# EAGLE design wchair (EAGLE 9.2.2)

## Sheet 1 of 2
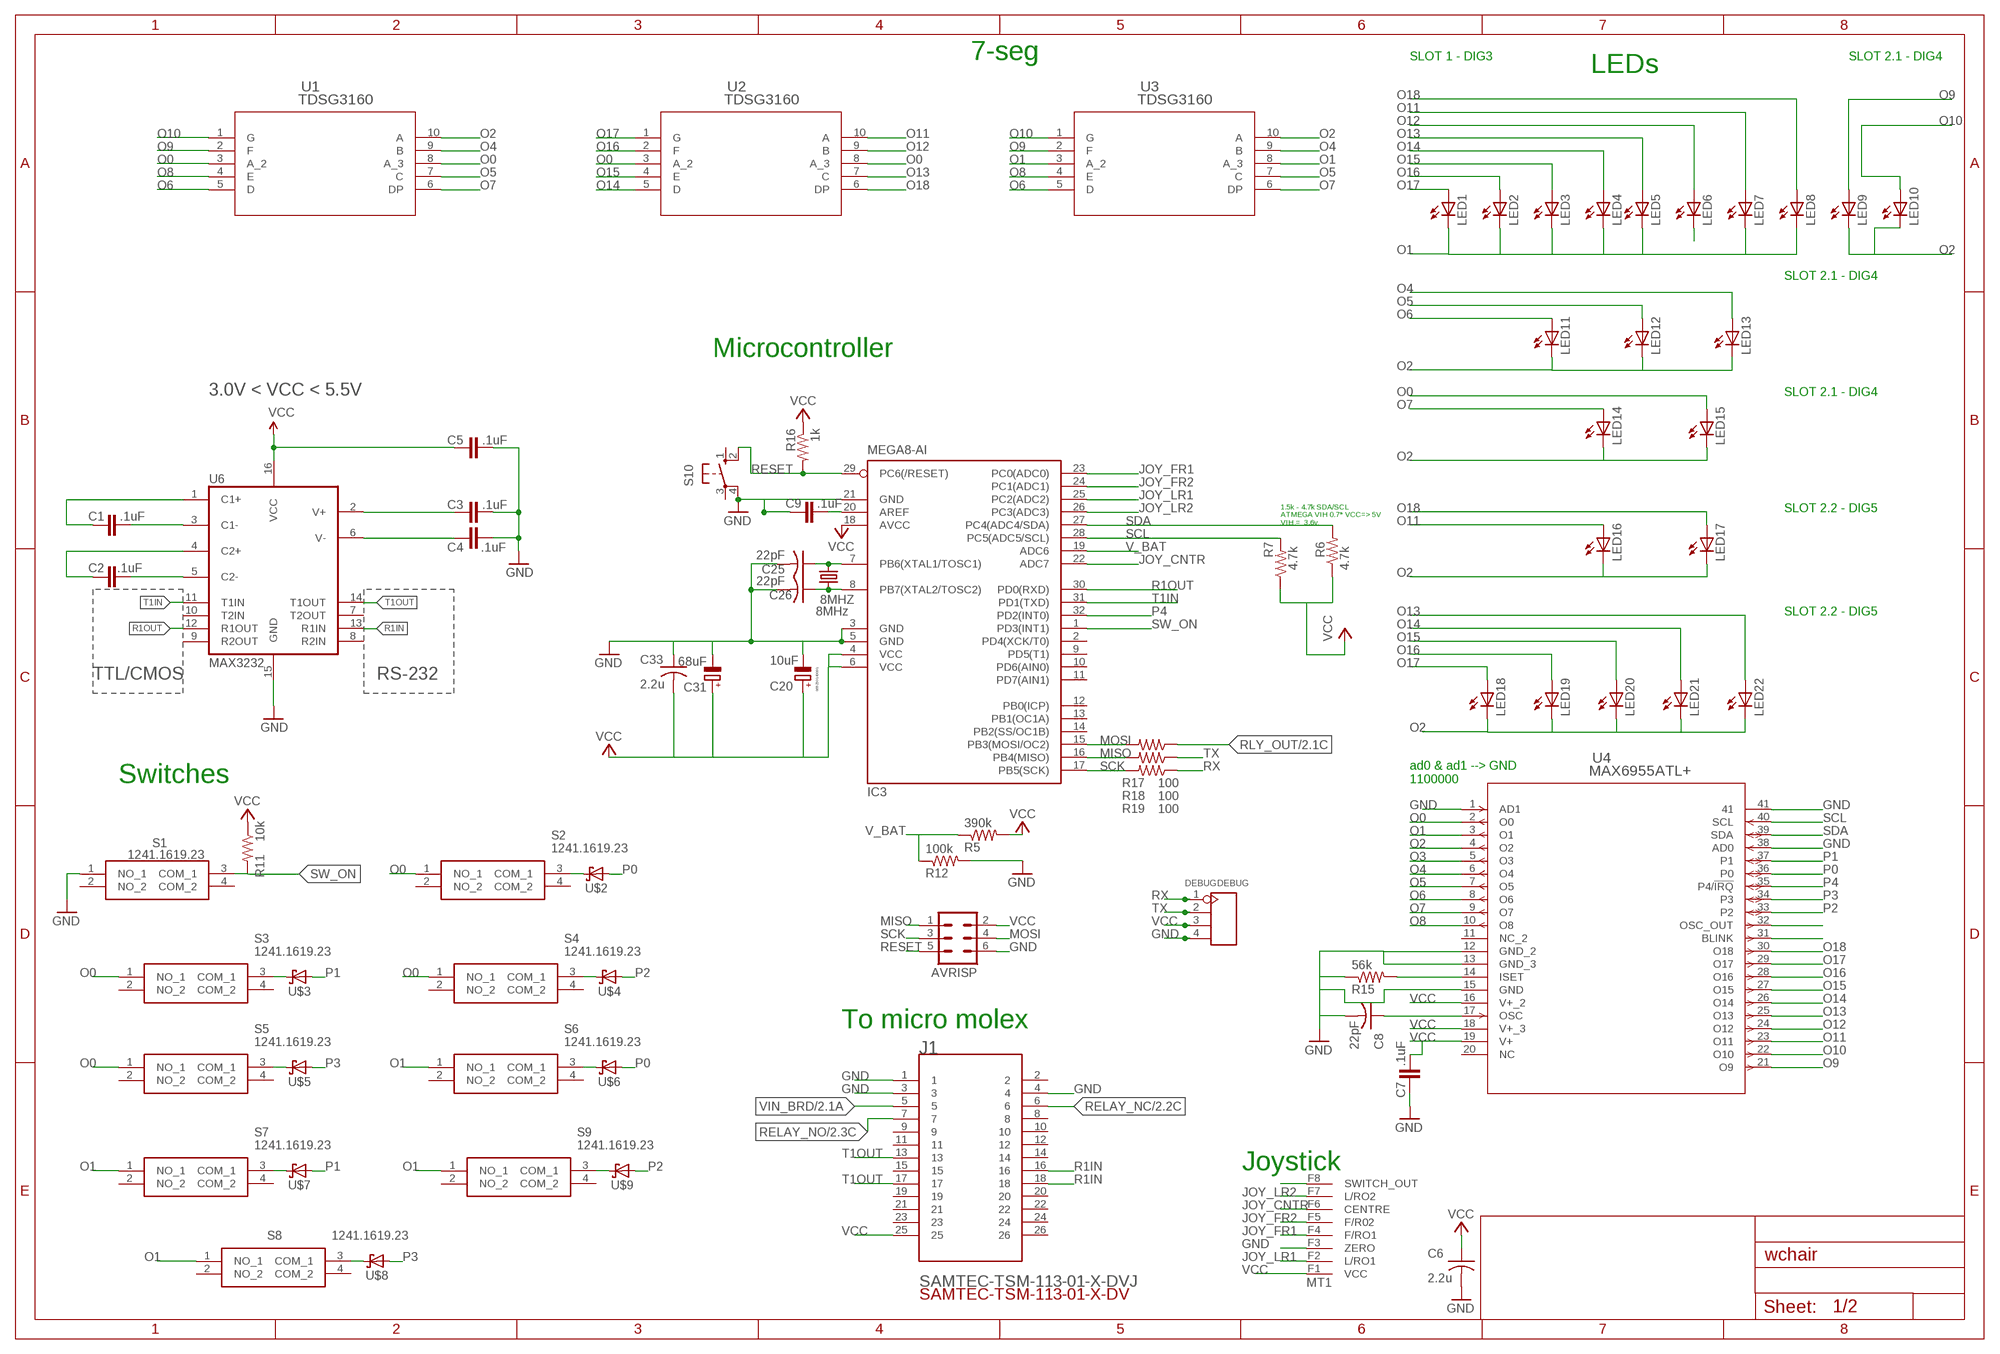
[diagram p0: schematic, sheet 1]

### Parts
8MHZ  8MHz  CRYSTALSM49  [SM49]
AVRISP  MA03-2  [MA03-2]
C1  .1uF  0.1UF-25V(+80/-20%)(0603)  [0603-CAP]
C2  .1uF  0.1UF-25V(+80/-20%)(0603)  [0603-CAP]
C3  .1uF  0.1UF-25V(+80/-20%)(0603)  [0603-CAP]
C4  .1uF  0.1UF-25V(+80/-20%)(0603)  [0603-CAP]
C5  .1uF  0.1UF-25V(+80/-20%)(0603)  [0603-CAP]
C6  2.2u  C-USC0603  [C0603]
C7  .1uF  0.1UF-25V(+80/-20%)(0603)  [0603-CAP]
C8  22pF  C-USC0603  [C0603]
C9  .1uF  0.1UF-25V(+80/-20%)(0603)  [0603-CAP]
C20  10uF  CPOL-EU153CLV-0405  [153CLV-0405]
C25  22pF  C-USC0603  [C0603]
C26  22pF  C-USC0603  [C0603]
C31  68uF  CPOL-EU153CLV-0807  [153CLV-0807]
C33  2.2u  C-USC0603  [C0603]
DEBUG  DEBUG  4-PIN-HEADER  [4-PIN-HEADER]
IC3  MEGA8-AI  [TQFP32-08]
J1  SAMTEC-TSM-113-01-X-DVJ  [SAMTEC-TSM-113-01-X-DV]
LED1  LEDCHIP-LED0805  [CHIP-LED0805]
LED2  LEDCHIP-LED0805  [CHIP-LED0805]
LED3  LEDCHIP-LED0805  [CHIP-LED0805]
LED4  LEDCHIP-LED0805  [CHIP-LED0805]
LED5  LEDCHIP-LED0805  [CHIP-LED0805]
LED6  LEDCHIP-LED0805  [CHIP-LED0805]
LED7  LEDCHIP-LED0805  [CHIP-LED0805]
LED8  LEDCHIP-LED0805  [CHIP-LED0805]
LED9  LEDCHIP-LED0805  [CHIP-LED0805]
LED10  LEDCHIP-LED0805  [CHIP-LED0805]
LED11  LEDCHIP-LED0805  [CHIP-LED0805]
LED12  LEDCHIP-LED0805  [CHIP-LED0805]
LED13  LEDCHIP-LED0805  [CHIP-LED0805]
LED14  LEDCHIP-LED0805  [CHIP-LED0805]
LED15  LEDCHIP-LED0805  [CHIP-LED0805]
LED16  LEDCHIP-LED0805  [CHIP-LED0805]
LED17  LEDCHIP-LED0805  [CHIP-LED0805]
LED18  LEDCHIP-LED0805  [CHIP-LED0805]
LED19  LEDCHIP-LED0805  [CHIP-LED0805]
LED20  LEDCHIP-LED0805  [CHIP-LED0805]
LED21  LEDCHIP-LED0805  [CHIP-LED0805]
LED22  LEDCHIP-LED0805  [CHIP-LED0805]
MT1  MINITEK2-8PINS  [MINITEK2-8PINS]
R5  390k  R-US_R0603  [R0603]
R6  4.7k  R-US_R0603  [R0603]
R7  4.7k  R-US_R0603  [R0603]
R11  10k  R-US_R0603  [R0603]
R12  100k  R-US_R0603  [R0603]
R15  56k  R-US_R0603  [R0603]
R16  1k  R-US_R0603  [R0603]
R17  100  R-US_R0603  [R0603]
R18  100  R-US_R0603  [R0603]
R19  100  R-US_R0603  [R0603]
S1  1241.1619.23  [IP40-J-LEAD]
S2  1241.1619.23  [IP40-J-LEAD]
S3  1241.1619.23  [IP40-J-LEAD]
S4  1241.1619.23  [IP40-J-LEAD]
S5  1241.1619.23  [IP40-J-LEAD]
S6  1241.1619.23  [IP40-J-LEAD]
S7  1241.1619.23  [IP40-J-LEAD]
S8  1241.1619.23  [IP40-J-LEAD]
S9  1241.1619.23  [IP40-J-LEAD]
S10  10-XX  [B3F-10XX]
U1  TDSG3160  [DIP10_TDS]
U2  TDSG3160  [DIP10_TDS]
U3  TDSG3160  [DIP10_TDS]
U4  MAX6955ATL+  [21-0141I_T4066-5]
U6  MAX3232  MAX2323SOIC16  [SO16]
U$2  SCHOTTKY  [SOD-323]
U$3  SCHOTTKY  [SOD-323]
U$4  SCHOTTKY  [SOD-323]
U$5  SCHOTTKY  [SOD-323]
U$6  SCHOTTKY  [SOD-323]
U$7  SCHOTTKY  [SOD-323]
U$8  SCHOTTKY  [SOD-323]
U$9  SCHOTTKY  [SOD-323]

### Nets
C1+: C1.1 U6.1(C1+)
C1-: C1.2 U6.3(C1-)
C2+: C2.1 U6.4(C2+)
C2-: C2.2 U6.5(C2-)
GND: AVRISP.6 C3.2 C4.2 C5.2 C6.2 C7.1 C8.2 C9.1 C20.- C25.2 C26.2 C31.- C33.1 DEBUG.4 IC3.3(GND) IC3.5(GND) IC3.21(GND) J1.1 J1.3 J1.4 MT1.F3(ZERO) R12.2 R15.1 S1.1(NO_1) S10.4(P1) U4.1(AD1) U4.12(GND_2) U4.13(GND_3) U4.15(GND) U4.38(AD0) U4.41 U6.15(GND) ; also sheet 2
JOY_CNTR: IC3.22(ADC7) MT1.F6(CENTRE)
JOY_FR1: IC3.23(PC0(ADC0)) MT1.F4(F/RO1)
JOY_FR2: IC3.24(PC1(ADC1)) MT1.F5(F/R02)
JOY_LR1: IC3.25(PC2(ADC2)) MT1.F2(L/RO1)
JOY_LR2: IC3.26(PC3(ADC3)) MT1.F7(L/RO2)
MISO: AVRISP.1 IC3.16(PB4(MISO)) R18.2
MOSI: AVRISP.4 IC3.15(PB3(MOSI/OC2)) R19.2
N$1: S2.3(COM_1) U$2.C
N$2: MT1.F8(SWITCH_OUT)
N$3: S9.3(COM_1) U$9.C
N$6: LED6.C
N$8: S7.3(COM_1) U$7.C
N$11: U4.32(OSC_OUT)
N$16: S8.3(COM_1) U$8.C
N$18: S6.3(COM_1) U$6.C
N$20: S4.3(COM_1) U$4.C
N$21: S5.3(COM_1) U$5.C
N$22: S3.3(COM_1) U$3.C
N$30: U4.31(BLINK)
N$31: R15.2 U4.14(ISET)
N$32: C8.1 U4.17(OSC)
N$35: 8MHZ.2 C25.1 IC3.7(PB6(XTAL1/TOSC1))
N$36: 8MHZ.1 C26.1 IC3.8(PB7(XTAL2/TOSC2))
N$37: C9.2 IC3.20(AREF)
O0: LED15.A S2.1(NO_1) S3.1(NO_1) S4.1(NO_1) S5.1(NO_1) U1.3(A_2) U1.8(A_3) U2.3(A_2) U2.8(A_3) U4.2(O0)
O1: LED1.C LED2.C LED3.C LED4.C LED5.C LED7.C LED8.C S6.1(NO_1) S7.1(NO_1) S8.1(NO_1) S9.1(NO_1) U3.3(A_2) U3.8(A_3) U4.3(O1)
O2: LED9.C LED10.C LED11.C LED12.C LED13.C LED14.C LED15.C LED16.C LED17.C LED18.C LED19.C LED20.C LED21.C LED22.C U1.10(A) U3.10(A) U4.4(O2)
O3: U4.5(O3)
O4: LED13.A U1.9(B) U3.9(B) U4.6(O4)
O5: LED12.A U1.7(C) U3.7(C) U4.7(O5)
O6: LED11.A U1.5(D) U3.5(D) U4.8(O6)
O7: LED14.A U1.6(DP) U3.6(DP) U4.9(O7)
O8: U1.4(E) U3.4(E) U4.10(O8)
O9: LED9.A U1.2(F) U3.2(F) U4.21(O9)
O10: LED10.A U1.1(G) U3.1(G) U4.22(O10)
O11: LED7.A LED16.A U2.10(A) U4.23(O11)
O12: LED6.A U2.9(B) U4.24(O12)
O13: LED5.A LED22.A U2.7(C) U4.25(O13)
O14: LED4.A LED21.A U2.5(D) U4.26(O14)
O15: LED3.A LED20.A U2.4(E) U4.27(O15)
O16: LED2.A LED19.A U2.2(F) U4.28(O16)
O17: LED1.A LED18.A U2.1(G) U4.29(O17)
O18: LED8.A LED17.A U2.6(DP) U4.30(O18)
P0: U4.36(P0) U$2.A U$6.A
P1: U4.37(P1) U$3.A U$7.A
P2: U4.33(P2) U$4.A U$9.A
P3: U4.34(P3) U$5.A U$8.A
P4: IC3.32(PD2(INT0)) U4.35(P4/!IRQ)
R1IN: J1.16 J1.18 U6.13(R1IN)
R1OUT: IC3.30(PD0(RXD)) U6.12(R1OUT)
RELAY_NC: J1.6 ; also sheet 2
RELAY_NO: J1.7 ; also sheet 2
RESET: AVRISP.5 IC3.29(PC6(/RESET)) R16.2 S10.2(S1)
RLY_OUT: R19.1 ; also sheet 2
RX: DEBUG.1 R17.1
SCK: AVRISP.3 IC3.17(PB5(SCK)) R17.2
SCL: IC3.28(PC5(ADC5/SCL)) R7.2 U4.40(SCL)
SDA: IC3.27(PC4(ADC4/SDA)) R6.2 U4.39(SDA)
SW_ON: IC3.1(PD3(INT1)) R11.2 S1.3(COM_1)
T1IN: IC3.31(PD1(TXD)) U6.11(T1IN)
T1OUT: J1.13 J1.17 U6.14(T1OUT)
TX: DEBUG.2 R18.1
V+: C3.1 U6.2(V+)
V-: C4.1 U6.6(V-)
V_BAT: IC3.19(ADC6) R5.1 R12.1
VCC [supply]: AVRISP.2 C5.1 C6.1 C7.2 C20.+ C31.+ C33.2 DEBUG.3 IC3.4(VCC) IC3.6(VCC) IC3.18(AVCC) J1.25 MT1.F1(VCC) R5.2 R6.1 R7.1 R11.1 R16.1 U4.16(V+_2) U4.18(V+_3) U4.19(V+) U6.16(VCC) ; also sheet 2
VIN_BRD: J1.5 ; also sheet 2
Unconnected: IC3.2(PD4(XCK/T0)) IC3.9(PD5(T1)) IC3.10(PD6(AIN0)) IC3.11(PD7(AIN1)) IC3.12(PB0(ICP)) IC3.13(PB1(OC1A)) IC3.14(PB2(SS/OC1B)) J1.2 J1.8 J1.9 J1.10 J1.11 J1.12 J1.14 J1.15 J1.19 J1.20 J1.21 J1.22 J1.23 J1.24 J1.26 S1.2(NO_2) S1.4(COM_2) S2.2(NO_2) S2.4(COM_2) S3.2(NO_2) S3.4(COM_2) S4.2(NO_2) S4.4(COM_2) S5.2(NO_2) S5.4(COM_2) S6.2(NO_2) S6.4(COM_2) S7.2(NO_2) S7.4(COM_2) S8.2(NO_2) S8.4(COM_2) S9.2(NO_2) S9.4(COM_2) S10.1(S) S10.3(P) U4.11(NC_2) U4.20(NC) U6.7(T2OUT) U6.8(R2IN) U6.9(R2OUT) U6.10(T2IN)

### Notes on the sheet
- 7-seg | SLOT 1 - DIG3 | SLOT 2.1 - DIG4
- LEDs
- SLOT 2.1 - DIG4
- Microcontroller
- 3.0V < VCC < 5.5V | SLOT 2.1 - DIG4
- SLOT 2.2 - DIG5
- 1.5k - 4.7k SDA/SCL 
  ATMEGA VIH 0.7* VCC=> 5V
  VIH =  3.6v
- SLOT 2.2 - DIG5
- TTL/CMOS | RS-232
- Switches
- ad0 & ad1 --> GND
  1100000
- To micro molex
- Joystick

## Sheet 2 of 2
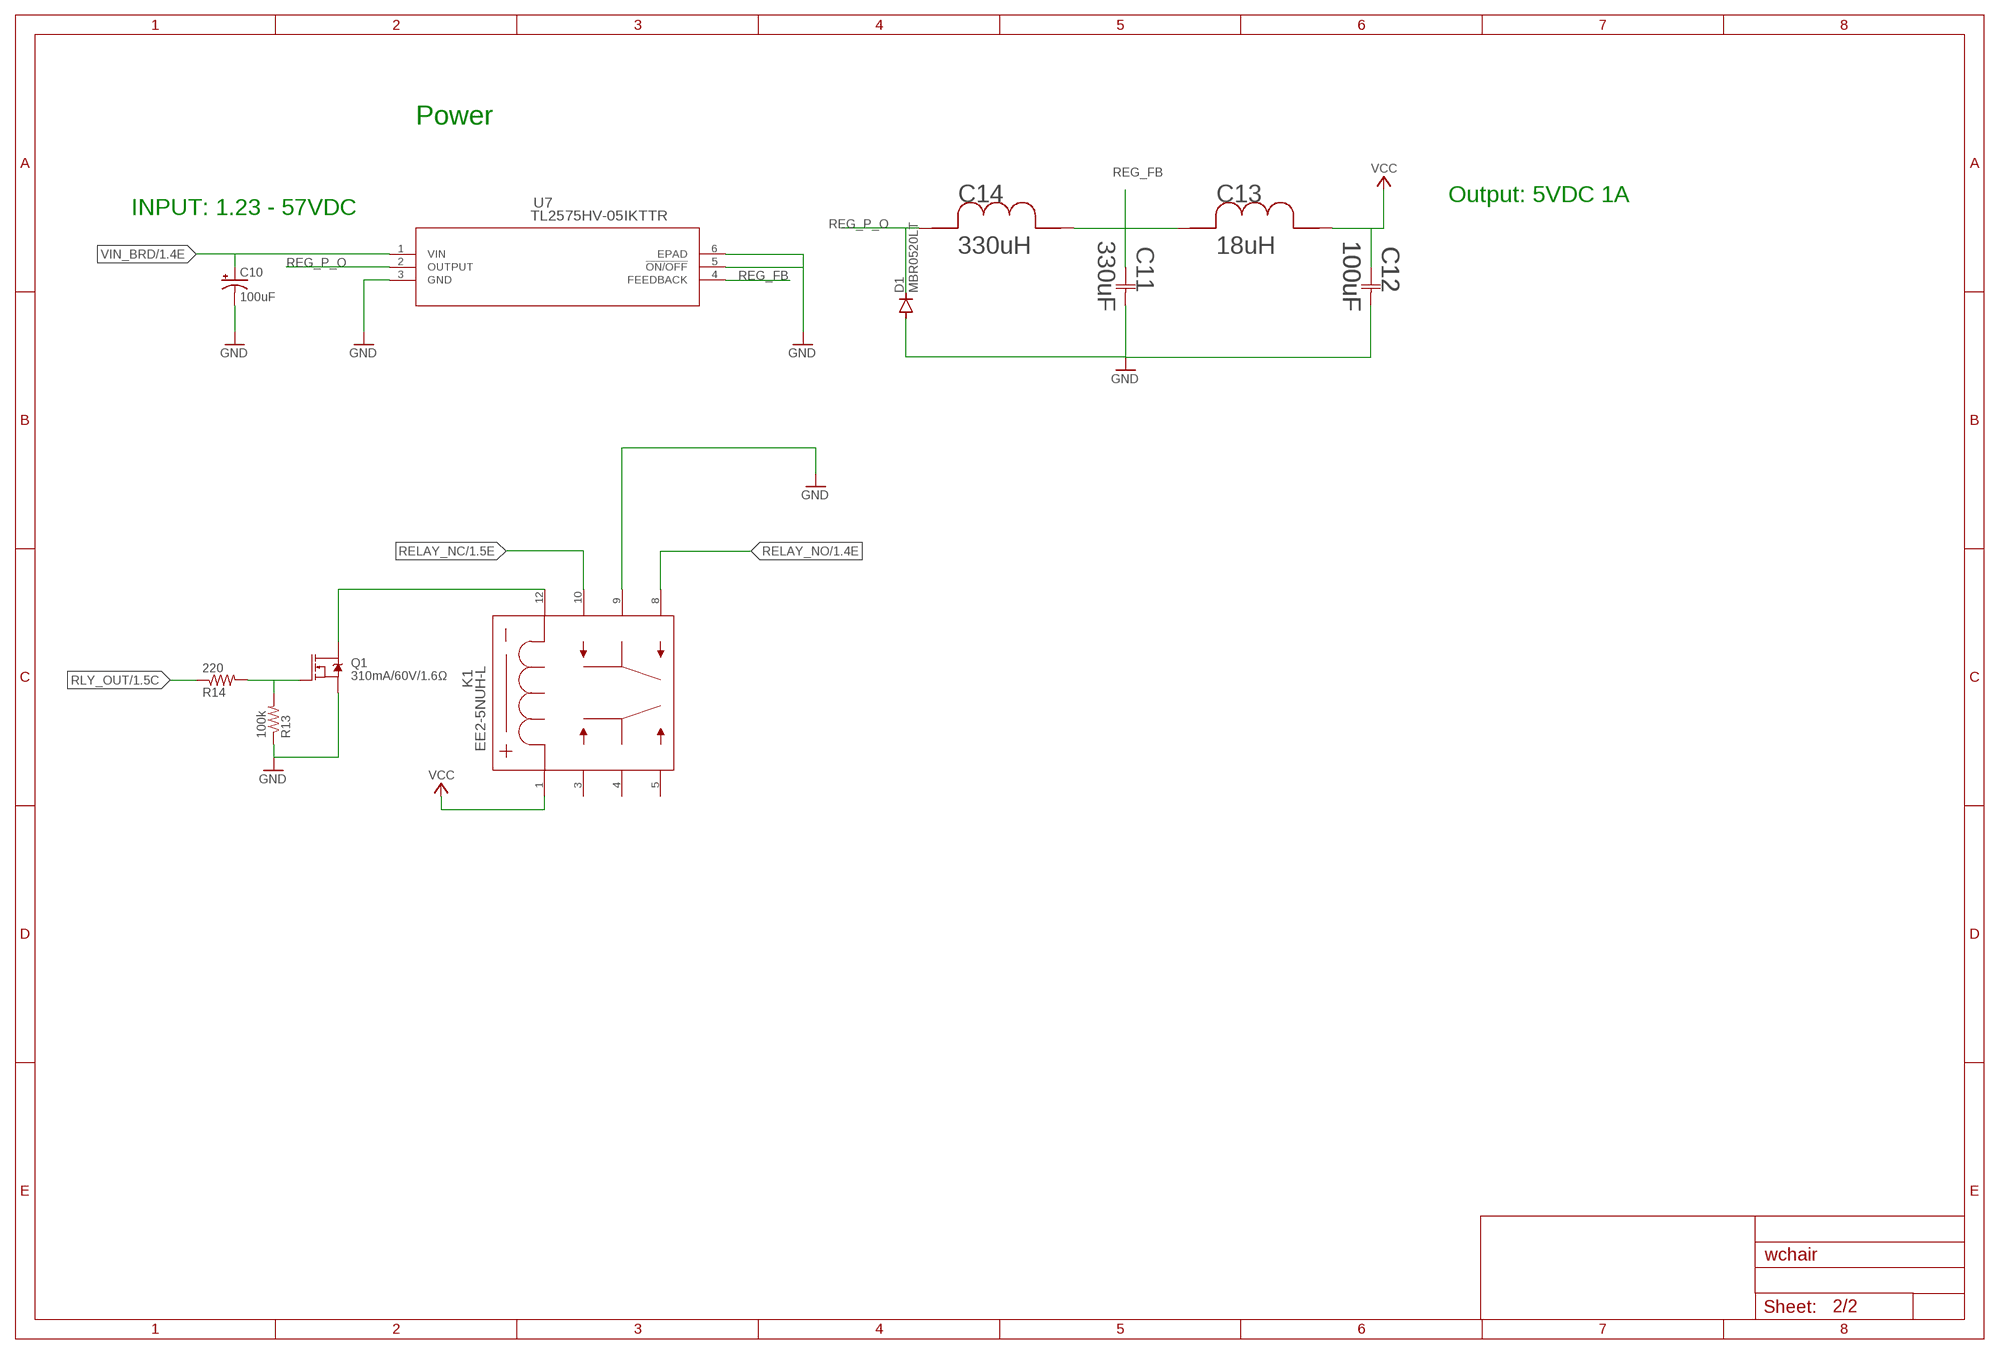
[diagram p1: schematic, sheet 2]

### Parts
C10  100uF  100UF-POLAR-10X10.5-63V-20%  [NIC_10X10.5_CAP]
C11  330uF  EEE-FK0J331XP  [CAP_EEFK_D8]
C12  100uF  EEE-0JA101SP  [CAP_EEE_D]
C13  18uH  INDUCTOR18UH2.15A  [18UH2.15A]
C14  330uH  INDUCTOR  [732-1698-1-ND]
D1  MBR0520LT  [SOD123]
K1  EE2-5NUH-L  [EE2NUH]
Q1  310mA/60V/1.6Ω  MOSFET-NCH-2N7002PW  [SOT323]
R13  100k  R-US_R0603  [R0603]
R14  220  R-US_R0603  [R0603]
U7  TL2575HV-05IKTTR  [KTT5_6P22X6P86]

### Nets
GND: C10.- C11.2 C12.2 D1.A K1.9 Q1.2(S) R13.1 U7.3(GND) U7.5(!ON/OFF) U7.6(EPAD) ; also sheet 1
N$17: Q1.1(G) R13.2 R14.2
N$19: K1.12 Q1.3(D)
REG_FB: C11.1 C13.1 C14.2 U7.4(FEEDBACK)
REG_P_O: C14.1 D1.C U7.2(OUTPUT)
RELAY_NC: K1.10 ; also sheet 1
RELAY_NO: K1.8 ; also sheet 1
RLY_OUT: R14.1 ; also sheet 1
VCC [supply]: C12.1 C13.2 K1.1 ; also sheet 1
VIN_BRD: C10.+ U7.1(VIN) ; also sheet 1
Unconnected: K1.3 K1.4 K1.5

### Notes on the sheet
- Power
- Output: 5VDC 1A
- INPUT: 1.23 - 57VDC

## Library data of the parts
8MHZ = crystal:CRYSTAL: CRYSTAL; DIGIKEY: 535-9089-1-ND; OC_FARNELL: unknown; OC_NEWARK: unknown
AVRISP = con-lstb:MA03-2: PIN HEADER; DIGIKEY: ED10665-ND; OC_FARNELL: unknown; OC_NEWARK: unknown
C1-C5 C7 C9 = SparkFun-Capacitors:0.1UF-25V(+80/-20%)(0603): CAP-00810 Ceramic Standard decoupling cap; DIGIKEY: 399-15351-1-ND; PROD_ID: CAP-00810; SPARKLE_ID: 918; VALUE: 0.1uF
C6 C33 = adafruit:C-US: CAPACITOR, American symbol; DIGIKEY: 1276-1183-1-ND
C8 C25 C26 = adafruit:C-US: CAPACITOR, American symbol; DIGIKEY: 478-11384-1-ND
C10 = SparkFun-Capacitors:100UF-POLAR: 100µF polarized capacitors A capacitor is a passive two-terminal electrical component used to store electrical energy temporarily in an electric field.; DIGIKEY: PCE3942CT-ND; PROD_ID: CAP-08362; SPICEPREFIX: C
C11 = my_lib:EEE-FK0J331XP; DIGIKEY: PCE3768CT-ND; MANUFACTURER_PART_NUMBER: EEEFK0J331XP; VENDOR: Panasonic
C12 = my_lib:EEE-0JA101SP; DIGIKEY: PCE3852CT-ND; MANUFACTURER_PART_NUMBER: EEE0JA101SP; VENDOR: Panasonic
C13 = AAAmy_lib_chair:INDUCTOR; DIGIKEY: 732-4533-1-ND
C14 = AAAmy_lib_chair:INDUCTOR; DIGIKEY: 732-1698-1-ND
C20 = rcl:CPOL-EU: POLARIZED CAPACITOR, European symbol; CODE: 865250140001; DIGIKEY: 493-2173-1-ND; SPICEPREFIX: C
C31 = rcl:CPOL-EU: POLARIZED CAPACITOR, European symbol; CODE: EEEFC0J680P; DIGIKEY: PCE4412CT-ND‎; SPICEPREFIX: C
D1 = diode:MBR0520LT: SCHOTTKY BARRIER RECTIFIER Source: http://onsemi.com .. MBR0520LT1-D.pdf; DIGIKEY: MBR0520LCT-ND
DEBUG = AAAmy_lib_chair:4-PIN-HEADER; DIGIKEY: 0
IC3 = atmel:MEGA8: MICROCONTROLLER 8 Kbytes FLASH, 1 kbytes SRAM, 512 bytes EEPROM, USART, 6-channel 10 bit ADC, 2-channel 8 bit ADC Pin compatible with Atmega48, ATMega88, ATMega168 Source: avr.lbr; DIGIKEY: ATMEGA328P-AU-ND; MPN: ATMEGA8-16AU; OC_FARNELL: 9171371; OC_NEWARK: 73M8863
J1 = SAMTEC-TSM-113-01-X-DV:SAMTEC-TSM-113-01-X-DV; DESCRIPTION: Conn Unshrouded Header HDR 26 POS 2.54mm Solder ST SMD Automotive Tube; DIGI-KEY_PURCHASE_URL: https://www.digikey.com/product-detail/en/samtec-inc/TSM-113-01-L-DV/SAM10304-ND/6679041?utm_source=snapeda&utm_medium=aggregator&utm_campaign=symbol; DIGIKEY: SAM10304-ND; MF: Samtec Inc.; MP: TSM-113-01-L-DV; PACKAGE: None
K1 = AAAmy_lib_chair:EE2-5NUH-L; DIGIKEY: 399-11016-1-ND‎; MANUFACTURER_PART_NUMBER: EE25NUHL; VENDOR: KEMET
LED1-LED22 = led:LED: LED OSRAM: - CHIPLED LG R971, LG N971, LY N971, LG Q971, LY Q971, LO R971, LY R971 LH N974, LH R974 LS Q976, LO Q976, LY Q976 LO Q996 - Hyper CHIPLED LW Q18S LB Q993, LB Q99A, LB R99A - SideLED LS A670, LO A670, LY A670, LG A670, LP A670 LB A673, LV A673, LT A673, LW A673 LH A674 LY A675 LS A676, LA A676, LO A676, LY A676, LW A676 LS A679, LY A679, LG A679 - Hyper Micro SIDELED® LS Y876, LA Y876, LO Y876, LY Y876 LT Y87S - SmartLED LW L88C, LW L88S LB L89C, LB L89S, LG L890 LS L89K, LO L89K, LY L89K LS L896, LA L896, LO L896, LY L896 - TOPLED LS T670, LO T670, LY T670, LG T670, LP T670 LSG T670, LSP T670, LSY T670, LOP T670, LYG T670 LG T671, LOG T671, LSG T671 LB T673, LV T673, LT T673, LW T673 LH T674 LS T676, LA T676, LO T676, LY T676, LB T676, LH T676, LSB T676, LW T676 LB T67C, LV T67C, LT T67C, LS T67K, LO T67K, LY T67K, LW E67C LS E67B, LA E67B, LO E67B, LY E67B, LB E67C, LV E67C, LT E67C LW T67C LS T679, LY T679, LG T679 LS T770, LO T770, LY T770, LG T770, LP T770 LB T773, LV T773, LT T773, LW T773 LH T774 LS E675, LA E675, LY E675, LS T675 LS T776, LA T776, LO T776, LY T776, LB T776 LHGB T686 LT T68C, LB T68C - Hyper Mini TOPLED® LB M676 - Mini TOPLED Santana® LG M470 LS M47K, LO M47K, LY M47K Source: http://www.osram.convergy.de LUXEON: - LUMILED® LXK2-PW12-R00, LXK2-PW12-S00, LXK2-PW14-U00, LXK2-PW14-V00 LXK2-PM12-R00, LXK2-PM12-S00, LXK2-PM14-U00 LXK2-PE12-Q00, LXK2-PE12-R00, LXK2-PE12-S00, LXK2-PE14-T00, LXK2-PE14-U00 LXK2-PB12-K00, LXK2-PB12-L00, LXK2-PB12-M00, LXK2-PB14-N00, LXK2-PB14-P00, LXK2-PB14-Q00 LXK2-PR12-L00, LXK2-PR12-M00, LXK2-PR14-Q00, LXK2-PR14-R00 LXK2-PD12-Q00, LXK2-PD12-R00, LXK2-PD12-S00 LXK2-PH12-R00, LXK2-PH12-S00 LXK2-PL12-P00, LXK2-PL12-Q00, LXK2-PL12-R00 Source: www.luxeon.com KINGBRIGHT: KA-3528ASYC Source: www.kingbright.com; DIGIKEY: 1497-1434-1-ND
MT1 = my_lib:MINITEK2-8PINS; DIGIKEY: 609-5175-1-ND
Q1 = SparkFun-DiscreteSemi:MOSFET-NCH: N-channel MOSFETs Voltage controlled devices that allow control of high current outputs. SparkFun Products: SparkFun OpenScale <https://www.sparkfun.com/products/13261> SparkFun Digital Sandbox <https://www.sparkfun.com/products/12651> SparkFun Monster Moto Shield <https://www.sparkfun.com/products/10182> SparkFun MOSFET Power Controller <https://www.sparkfun.com/products/11214>; DIGIKEY: SI2304BDS-T1-GE3CT-ND; PROD_ID: TRANS-11151
R5 = adafruit:R-US_: RESISTOR, American symbol; DIGIKEY: 311-390KGRCT-ND
R6 R7 = adafruit:R-US_: RESISTOR, American symbol; DIGIKEY: 311-4.7KGRCT-ND
R11 = rcl:R-US_: RESISTOR, American symbol; DIGIKEY: RNCP0603FTD10K0CT-ND
R12 R13 = adafruit:R-US_: RESISTOR, American symbol; DIGIKEY: RR08P100KDCT-ND
R14 = adafruit:R-US_: RESISTOR, American symbol; DIGIKEY: A130087CT-ND
R15 = adafruit:R-US_: RESISTOR, American symbol; DIGIKEY: 749-1667-1-ND
R16 = rcl:R-US_: RESISTOR, American symbol; DIGIKEY: RHM1.0KDCT-ND
R17-R19 = rcl:R-US_: RESISTOR, American symbol; DIGIKEY: RR08P100DCT-ND
S1-S9 = my_pushbot:1241.1619.23: 1-pole on-off switch Latching Push Button Switch, IP67, PCB, 30 V ac, 42 V dc Source: Datasheet <https://componentsearchengine.com/Datasheets/1/1241.1619.23.pdf>; DESCRIPTION: 1-pole on-off switch Latching Push Button Switch, IP67, PCB, 30 V ac, 42 V dc; DIGIKEY: 486-1931-1-ND; HEIGHT: mm; MANUFACTURER_NAME: SCHURTER; MANUFACTURER_PART_NUMBER: 1241.1619.23; MOUSER_PART_NUMBER: 693-1241.1619.23; MOUSER_PRICE-STOCK: https://www.mouser.com/Search/Refine.aspx?Keyword=693-1241.1619.23
S10 = switch-omron:10-XX: OMRON SWITCH; DIGIKEY: SW400-ND; MPN: B3F-1000; OC_FARNELL: 176432; OC_NEWARK: 36M3542
U1-U3 = 7segment:TDSG3160; DIGIKEY: TDSG3160-M-ND; MANUFACTURER_PART_NUMBER: TDSG3160; VENDOR: Vishay
U4 = AAAmy_lib_chair:MAX6955ATL+; DIGIKEY: MAX6955ATL+-ND; MANUFACTURER_PART_NUMBER: MAX6955ATL+; VENDOR: Maxim Integrated Products
U6 = SparkFun-IC-Comms:MAX2323: RS232 Transceiver This part covers 232 drivers that are compatible with the MAX3232. Sipex SP3232EB Datasheet <http://cdn.sparkfun.com/datasheets/Components/General%20IC/SP3232EBCA-L.pdf> SparkFun Products SOIC component <https://www.sparkfun.com/products/589> (COM-00589 / IC-08171) Retired DIP component (COM-00316 / IC-08446) SparkFun Transceiver Breakout - MAX3232 <https://www.sparkfun.com/products/11189> (BOB-11189) SparkFun XBee Explorer Serial <https://www.sparkfun.com/products/13225> (WRL-13225); DIGIKEY: 296-14619-1-ND; PROD_ID: IC-08171
U7 = my_lib:TL2575HV-05IKTTR; DIGIKEY: 296-21833-1-ND; MANUFACTURER_PART_NUMBER: TL2575HV05IKTTR; VENDOR: Texas Instruments
U$2-U$9 = AAAmy_lib_chair:SCHOTTKY; DIGIKEY: CUS520H3FDKR-ND

## Net classes
1 supply: width 0.127 mm, clearance 0.203 mm

## Board
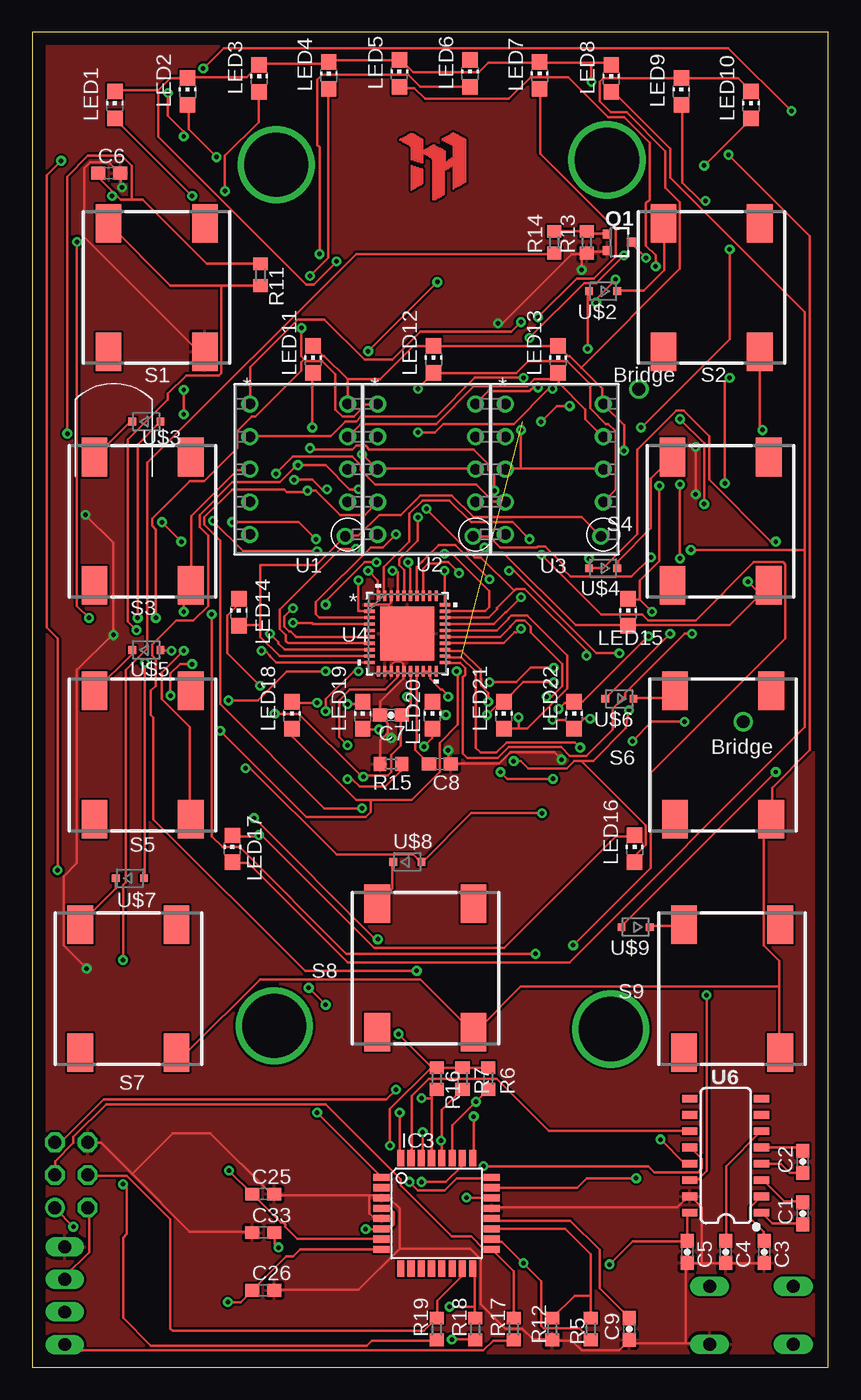
[diagram p2: board, top side]
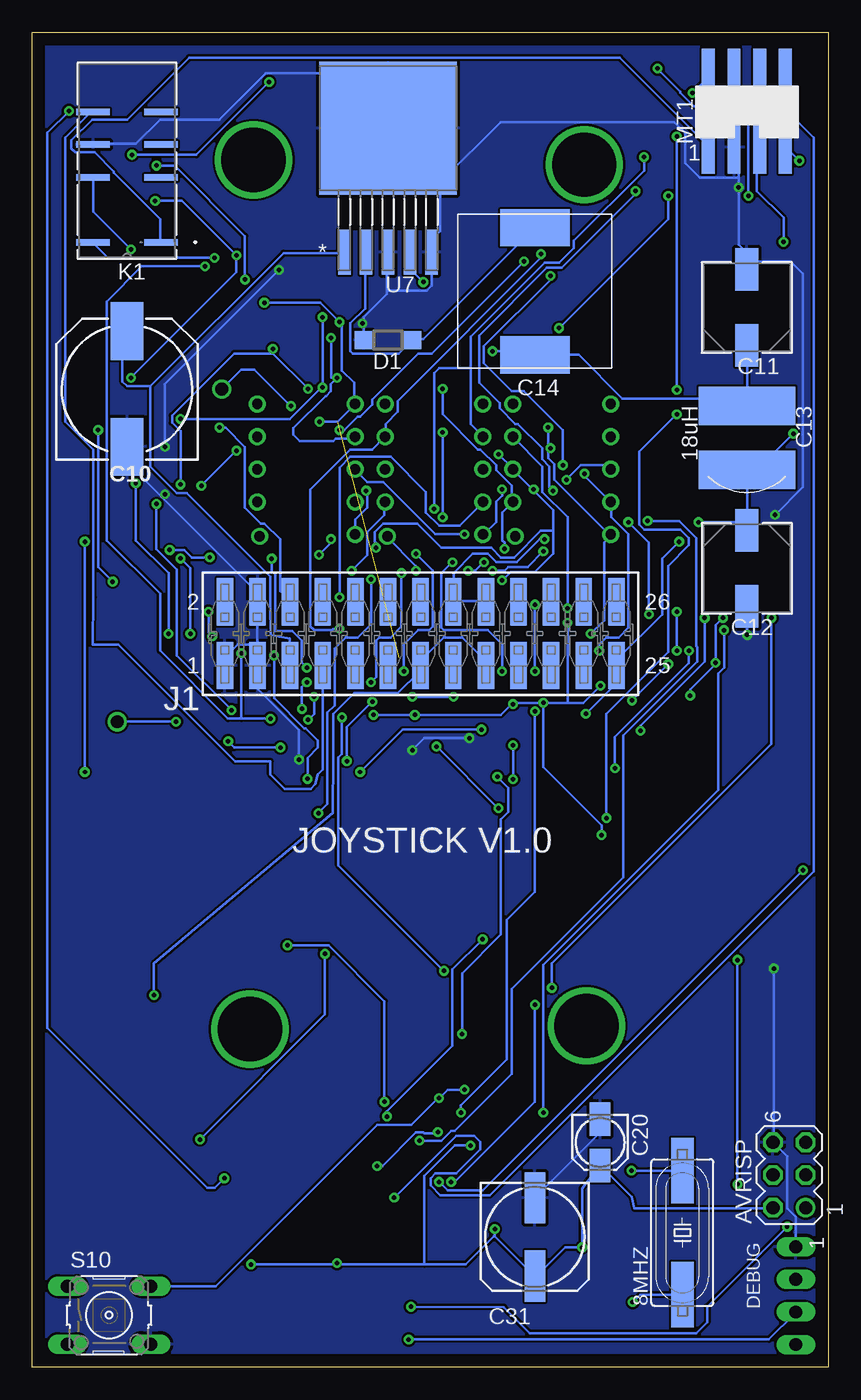
[diagram p3: board, bottom side, seen from below]

Size 62 x 104 mm. Coordinates in mm from the lower left corner, seen from the top.
Outline: 0,0 62,0 62,104 0,104 0,0
Copper layers (1*16): Top 0.035mm / dielectric 1.5mm / Bottom 0.035mm
Design rules "default *": minimum track width 0.2mm, minimum drill 0.35mm, track to track 7mil, track to pad 7mil, pad to pad 7mil, via to via 7mil, smd to smd 6mil, copper to edge 40mil, drill to drill 6mil, minimum pad ring 10mil, minimum via ring 8mil, stop-mask expansion 4mil, vias tented up to drill 0mil, thermal gap 10mil

### Footprints (pad centres in the part's own frame; a part is rotated, then mirrored left to right if it is on the bottom)
SM49 = smd 5.08 x 1.778: 1 -4.826,0; 2 4.826,0
MA03-2 = drill 1.016: 1 -2.54,-1.27 | drill 1.016 octagon: 2 -2.54,1.27; 3 0,-1.27; 4 0,1.27; 5 2.54,-1.27; 6 2.54,1.27
0603-CAP = smd 1.1 x 1: 1 -0.85,0; 2 0.85,0
C0603 = smd 1.1 x 1: 1 -0.85,0; 2 0.85,0
NIC_10X10.5_CAP = smd 4.5 x 2.5: + 4.5,0; - -4.5,0
CAP_EEFK_D8 = smd 3.302 x 1.778: 1 -2.959,0; 2 2.959,0
CAP_EEE_D = smd 3.302 x 1.778: 1 -2.959,0; 2 2.959,0
18UH2.15A = smd 3 x 7.5: 1 -2.5,0; 2 2.5,0
732-1698-1-ND = smd 5.4 x 2.9: 1 0,4.95; 2 0,-4.95
153CLV-0405 = smd 2.6 x 1.6: + 1.8,0; - -1.8,0
153CLV-0807 = smd 4 x 1.6: + 3.05,0; - -3.05,0
SOD123 = smd 1.4 x 1.4: A 1.9,0; C -1.9,0
4-PIN-HEADER = drill 1 long: 1 -3.81,0; 2 -1.27,0; 3 1.27,0; 4 3.81,0
TQFP32-08 = smd 1.27 x 0.559: 1 -4.293,2.8; 2 -4.293,2; 3 -4.293,1.2; 4 -4.293,0.4; 5 -4.293,-0.4; 6 -4.293,-1.2; 7 -4.293,-2; 8 -4.293,-2.8; 17 4.293,-2.8; 18 4.293,-2; 19 4.293,-1.2; 20 4.293,-0.4; 21 4.293,0.4; 22 4.293,1.2; 23 4.293,2; 24 4.293,2.8 | smd 0.559 x 1.27: 9 -2.8,-4.293; 10 -2,-4.293; 11 -1.2,-4.293; 12 -0.4,-4.293; 13 0.4,-4.293; 14 1.2,-4.293; 15 2,-4.293; 16 2.8,-4.293; 25 2.8,4.293; 26 2,4.293; 27 1.2,4.293; 28 0.4,4.293; 29 -0.4,4.293; 30 -1.2,4.293; 31 -2,4.293; 32 -2.8,4.293
SAMTEC-TSM-113-01-X-DV = smd 1.27 x 3.68: 1 -15.24,-2.476; 2 -15.24,2.476; 3 -12.7,-2.476; 4 -12.7,2.476; 5 -10.16,-2.476; 6 -10.16,2.476; 7 -7.62,-2.476; 8 -7.62,2.476; 9 -5.08,-2.476; 10 -5.08,2.476; 11 -2.54,-2.476; 12 -2.54,2.476; 13 0,-2.476; 14 0,2.476; 15 2.54,-2.476; 16 2.54,2.476; 17 5.08,-2.476; 18 5.08,2.476; 19 7.62,-2.476; 20 7.62,2.476; 21 10.16,-2.476; 22 10.16,2.476; 23 12.7,-2.476; 24 12.7,2.476; 25 15.24,-2.476; 26 15.24,2.476
EE2NUH = smd 2.616 x 0.508: 1 -2.642,6.363; 3 -2.642,1.283; 4 -2.642,-1.257; 5 -2.642,-3.797; 8 2.642,-3.797; 9 2.642,-1.257; 10 2.642,1.283; 12 2.642,6.363
CHIP-LED0805 = smd 1.2 x 1.2: A 0,-1.05; C 0,1.05
MINITEK2-8PINS = smd 1 x 4.1: F1 -3,-2.75; F2 -3,2.85; F3 -1,-2.75; F4 -1,2.85; F5 1,-2.75; F6 1,2.85; F7 3,-2.75; F8 3,2.85
SOT323 = smd 0.7 x 0.7: 1 -0.65,-0.925; 2 0.65,-0.925; 3 0,0.925
R0603 = smd 1 x 1.1: 1 -0.85,0; 2 0.85,0
IP40-J-LEAD = smd 3 x 2: 1 -5,-3.75; 2 5,-3.75; 3 5,3.75; 4 -5,3.75
B3F-10XX = drill 1.016 long: 1 -3.251,2.261; 2 3.251,2.261; 3 -3.251,-2.261; 4 3.251,-2.261
DIP10_TDS = drill 0.813 pad 1.321: 1 -3.725,5.93; 2 -3.725,3.39; 3 -3.725,0.85; 4 -3.725,-1.69; 5 -3.725,-4.23; 6 3.707,-4.37; 7 3.895,-1.69; 8 3.895,0.85; 9 3.895,3.39; 10 3.895,5.93
21-0141I_T4066-5 = smd 0.813 x 0.254: 1 -2.946,2.25; 2 -2.946,1.75; 3 -2.946,1.25; 4 -2.946,0.75; 5 -2.946,0.25; 6 -2.946,-0.25; 7 -2.946,-0.75; 8 -2.946,-1.25; 9 -2.946,-1.75; 10 -2.946,-2.25; 21 2.946,-2.25; 22 2.946,-1.75; 23 2.946,-1.25; 24 2.946,-0.75; 25 2.946,-0.25; 26 2.946,0.25; 27 2.946,0.75; 28 2.946,1.25; 29 2.946,1.75; 30 2.946,2.25 | smd 0.254 x 0.813: 11 -2.25,-2.946; 12 -1.75,-2.946; 13 -1.25,-2.946; 14 -0.75,-2.946; 15 -0.25,-2.946; 16 0.25,-2.946; 17 0.75,-2.946; 18 1.25,-2.946; 19 1.75,-2.946; 20 2.25,-2.946; 31 2.25,2.946; 32 1.75,2.946; 33 1.25,2.946; 34 0.75,2.946; 35 0.25,2.946; 36 -0.25,2.946; 37 -0.75,2.946; 38 -1.25,2.946; 39 -1.75,2.946; 40 -2.25,2.946 | smd 4.191 x 4.191: 41 0,0
SO16 = smd 0.6 x 1.2: 1 -4.445,-2.8; 2 -3.175,-2.8; 3 -1.905,-2.8; 4 -0.635,-2.8; 5 0.635,-2.8; 6 1.905,-2.8; 7 3.175,-2.8; 8 4.445,-2.8; 9 4.445,2.8; 10 3.175,2.8; 11 1.905,2.8; 12 0.635,2.8; 13 -0.635,2.8; 14 -1.905,2.8; 15 -3.175,2.8; 16 -4.445,2.8
KTT5_6P22X6P86 = smd 0.965 x 3.505: 1 -3.4,-9.652; 2 -1.7,-9.652; 3 0,-9.652; 4 1.7,-9.652; 5 3.4,-9.652 | smd 10.719 x 10.363: 6 0,0
SOD-323 = smd 0.6 x 0.6: A 1.1,0; C -1.1,0

### Placement (x,y rotation side)
8MHZ  11.37,10.5 90 bottom
AVRISP  3.05,14.99 90 bottom
C1  60,12 90 top
C2  60,16.02 90 top
C3  57,9 270 top
C4  54,9 270 top
C5  51,9 270 top
C6  6,93 0 top
C7  27.94,50.8 0 top
C8  31.75,46.99 0 top
C9  46.5,3 90 top
C10  54.61,76.2 90 bottom
C11  6.35,82.55 90 bottom
C12  6.35,62.23 270 bottom
C13  6.35,72.39 270 bottom
C14  22.86,83.82 0 bottom
C20  17.78,17.53 270 bottom
C25  18,13.5 0 top
C26  18,6 0 top
C31  22.86,10.16 270 bottom
C33  18,10.5 0 top
D1  34.29,80.01 180 bottom
DEBUG  2.54,5.59 90 bottom
IC3  31.5,12 0 top
J1  31.75,57.15 0 bottom
K1  54.61,93.98 180 bottom
LED1  6.44,98.31 0 top
LED2  12.1,99.38 0 top
LED3  17.68,100.4 0 top
LED4  23.1,100.62 0 top
LED5  28.59,100.78 0 top
LED6  34.09,100.78 0 top
LED7  39.52,100.62 0 top
LED8  45.09,100.4 0 top
LED9  50.55,99.38 0 top
LED10  55.97,98.31 0 top
LED11  21.87,78.5 0 top
LED12  31.26,78.5 0 top
LED13  40.95,78.5 0 top
LED14  16.09,58.81 0 top
LED15  46.41,58.81 0 top
LED16  46.91,40.38 0 top
LED17  15.59,40.38 0 top
LED18  20.23,50.79 0 top
LED19  25.75,50.79 0 top
LED20  31.17,50.79 0 top
LED21  36.73,50.79 0 top
LED22  42.2,50.79 0 top
MT1  6.35,97.79 0 bottom
Q1  45.72,87.63 270 top
R5  43.5,3 270 top
R6  35.52,22.5 270 top
R7  33.51,22.5 270 top
R11  17.78,85.09 270 top
R12  40.5,3 270 top
R13  43.18,87.63 90 top
R14  40.64,87.63 90 top
R15  27.94,46.99 0 top
R16  31.5,22.5 270 top
R17  37.5,3 90 top
R18  34.5,3 90 top
R19  31.5,3 90 top
S1  9.7,84.1 90 top
S2  52.9,84.1 90 top
S3  8.6,65.9 90 top
S4  53.6,65.9 90 top
S5  8.6,47.7 90 top
S6  53.8,47.7 90 top
S7  7.5,29.5 90 top
S8  30.62,31.1 90 top
S9  54.5,29.5 90 top
S10  56.01,4.06 0 bottom
U1  20.68,69.1 0 top
U2  30.62,69.1 0 top
U3  40.58,69.1 0 top
U4  29.21,57.15 0 top
U6  54,16.5 90 top
U7  34.29,96.52 0 bottom
U$2  44.45,83.82 180 top
U$3  8.89,73.66 0 top
U$4  44.45,62.23 180 top
U$5  8.89,55.88 0 top
U$6  45.72,52.07 180 top
U$7  7.62,38.1 0 top
U$8  29.21,39.37 0 top
U$9  46.99,34.29 180 top

### Tracks (layer width: path | path; a pad name or v marks a point on that pad's centre or on a via)
C1+
  Top 0.2: C1.1 59.98,11.24 57.61,11.24 56.86,11.99 U6.1
C1-
  Top 0.2: C1.2 59.98,12.94 58.56,12.94 56.86,14.64 U6.3
C2+
  Top 0.2: 56.86,15.87 U6.4 58.3,15.87 59,15.17 C2.1
C2-
  Top 0.2: 56.86,17.19 U6.5 59.73,17.14 C2.2
GND  (via drill 0.35)
  Top 0.2: 50.91,1.89 46.75,1.89 46.56,2.08 C9.1 46.47,2.08 45.71,1.32 42.79,1.32 42.03,2.08 40.52,2.08 R12.2 40.42,2.17 39.01,2.17 38.16,3.02 36.84,3.02 34.95,4.91 34.95,8.41 34.1,9.26 28.62,9.26 | 50.91,1.89 52.7,1.89 S10.4 | 52.14,8.12 53.93,8.12 C4.2 54.02,8.12 56.95,8.12 C3.2 | 52.14,8.12 51,8.12 C5.2 50.91,8.12 50.91,1.89 | 52.14,8.12 52.14,12.47 51.29,13.32 U6.15 51.19,13.41 50.25,12.47 35.8,12.47 IC3.21 | 28.62,9.26 25.41,6.04 18.89,6.04 C26.2 | 28.62,9.26 28.62,12.37 27.86,13.13 27.3,13.13 IC3.3 27.11,13.22 26.92,13.41 26.26,13.41 | 26.26,13.41 18.89,13.41 C25.2 18.8,13.51 18.61,13.51 13.88,18.23 10.96,18.23 7.79,15.06 | 26.26,13.41 26.26,11.99 26.64,11.62 27.2,11.62 IC3.5 | 7.79,15.06 5.38,17.47 4.34,17.47 AVRISP.6 | 7.79,15.06 12.28,10.58 17.09,10.58 C33.1 | 27.63,49.35 27.67,49.4 27.67,50.15 27.11,50.72 C7.1 27.11,50.81 27.11,51.85 28.9,53.65 28.9,54.12 U4.15 28.9,54.21 28.9,54.78 28.71,54.97 | 27.63,49.35 27.11,48.83 27.11,47.04 R15.1 | 27.77,59.41 26.35,59.41 U4.1 | 27.77,59.41 27.96,59.6 27.96,60.07 U4.38 | U4.12 27.48,54.21 27.96,54.21 U4.13 27.96,54.31 27.96,54.69 28.24,54.97 28.71,54.97 | 28.71,54.97 28.71,56.67 29.18,57.14 U4.41 29.18,57.24 27.77,58.65 27.77,59.41 | v41.23,47.35 40.64,47.93 37.26,47.93 36.36,47.04 32.68,47.04 C8.2 32.68,47.13 32.4,47.41 v32.4,48.08 | v27.96,49.02 27.63,49.35 | v6.99,91.9 6.89,91.99 6.89,92.94 C6.2 6.8,93.03 5.95,93.88 4.53,93.88 4.06,93.41 4.06,88.03 12.94,79.15 13.41,79.15 S1.1 | v4.16,66.4 6.33,64.23 v6.33,57.05 6.23,57.05 3.5,54.31 3.5,39.29 2.46,38.25 2.46,32.87 v4.25,31.07 | Q1.2 44.77,86.89 43.35,86.89 43.26,86.8 R13.1
  Top 0.2: v36.27,81.32 36.65,81.32 42.03,86.7 43.16,86.7 R13.1 | v51.66,71.69 v51.66,68 | v42.79,85.48 42.79,86.61 R13.1
  Bottom 0.2: C20.- 17.69,18.38 C31.- | DEBUG.4 2.55,9.45 2.55,11.71 3.21,12.37 3.21,16.43 4.25,17.47 AVRISP.6 4.25,17.57 v4.25,31.07 | v41.23,47.35 41.23,49.63 44.39,52.8 44.39,54.59 J1.3 | J1.3 44.49,54.69 44.49,59.6 J1.4 44.49,59.69 44.49,60.35 51.9,67.77 | J1.1 46.94,54.69 46.94,55.35 46,56.29 44.58,56.29 J1.3 | 51.9,67.77 54.59,70.46 54.59,71.69 C10.- | v27.96,49.02 31.45,49.02 v32.4,48.08 | 6.99,92.66 6.99,94.73 7.27,95.02 MT1.F3 | 6.99,92.66 v6.99,91.9 6.99,87.46 5.76,86.23 C11.2 6.33,85.57 5.76,86.14 2.93,86.14 1.98,85.19 1.98,68.57 v4.16,66.4 | v6.33,57.05 6.33,59.22 C12.2 | 36.17,81.32 36.17,81.79 34.38,83.59 34.38,83.87 | 36.17,81.32 36.17,80.09 D1.A | 34.38,83.87 34.38,86.8 U7.3 | v36.27,81.32 36.17,81.32 | 34.38,83.87 31.26,83.87 30.89,84.25 30.89,86.8 U7.5 30.89,86.89 30.89,87.84 30.22,88.5 30.22,92.37 34.28,96.43 U7.6 | K1.9 57.24,95.3 53.93,95.3 52.04,97.19 47.41,97.19 43.83,100.78 38.63,100.78 34.38,96.53 U7.6 | 6.99,92.66 10.01,92.66 11.14,93.79 11.14,96.15 11.99,97 25.5,97 30.13,92.37 U7.6 | v51.66,68 51.9,67.77 | v51.66,71.69 51.66,76.6 v42.79,85.48
  pour Top: 0,0 61.98,0 61.98,104.14 0,104.14
  pour Bottom: 0,0 61.98,0 61.98,104.14 0,104.14
JOY_CNTR  (via drill 0.35)
  Top 0.2: v33.81,13.22 35.7,13.22 IC3.22
  Bottom 0.2: v33.81,13.22 29,18.04 27.58,18.04 27.11,17.57 27.11,17 29,15.11 30.6,15.11 30.98,14.73 30.98,14.17 30.22,13.41 26.35,13.41 1.13,38.63 1.13,95.77 3.59,98.23 3.97,98.23 5.29,99.55 5.29,100.59 MT1.F6
JOY_FR1  (via drill 0.35)
  Top 0.2: IC3.23 42.45,14 43.18,14.73 43.26,14.73 v47.04,14.73 | v59.13,97.85 54.21,102.76 14.92,102.76 v13.32,101.16
  Bottom 0.2: v47.04,14.73 47.79,13.98 48.36,13.98 60.83,26.45 60.83,96.15 v59.13,97.85 | v13.32,101.16 11.52,99.36 11.52,99.27 10.48,98.23 8.78,98.23 7.37,99.64 7.37,100.59 MT1.F4
JOY_FR2  (via drill 0.35)
  Top 0.2: v29.37,14.45 30.04,13.79 32.11,13.79 33.06,14.73 35.7,14.73 IC3.24 | v21.54,29.56 v22.86,28.24 | v4.44,58.37 3.5,59.31 v3.5,87.65
  Bottom 0.2: v29.37,14.45 29.09,14.45 22.86,20.68 v22.86,28.24 | v21.54,29.56 21.54,31.45 4.44,48.55 v4.44,58.37 | v3.5,87.65 3.5,89.54 5.57,91.62 5.57,94.83 5.38,95.02 MT1.F5
JOY_LR1  (via drill 0.35)
  Top 0.2: v34.38,19.55 34.38,16.34 IC3.25 | v26.92,33.34 26.73,33.34 v17.28,42.79 | v11.81,76.13 v11.81,74.24 | v11.81,95.87 11.81,96.25 10.58,97.47 v10.58,99.27
  Bottom 0.2: v34.38,19.55 34.38,19.93 29.28,25.03 29.28,30.98 v26.92,33.34 | v17.28,42.79 17.28,50.91 12.47,55.73 12.47,62.43 10.86,64.04 10.86,64.6 11.52,65.27 14.36,65.27 14.73,65.64 14.73,71.31 v11.81,74.24 | v11.81,95.87 v11.81,76.13 | v10.58,99.27 9.26,100.59 MT1.F2
JOY_LR2  (via drill 0.35)
  Top 0.2: v30.32,14.45 32.21,14.45 33.44,15.68 33.44,16.25 IC3.26 | v1.98,38.72 1.98,56.76 1.13,57.61 1.13,92.84 v2.27,93.98
  Bottom 0.2: v30.32,14.45 29.66,13.79 26.92,13.79 v1.98,38.72 | v2.27,93.98 3.31,95.02 MT1.F7
MISO  (via drill 0.35)
  Top 0.2: 34.47,4.72 34.47,7.56 34.38,7.65 IC3.16 | 34.47,4.72 34.47,3.87 R18.2 | v32.49,4.72 34.47,4.72 | v3.21,10.96 1.79,12.37 AVRISP.1
  Bottom 0.2: v32.49,4.72 25.27,4.7 23.24,2.67 10.29,2.67 9.45,3.51 9.45,4.72 v3.21,10.96
MOSI
  Top 0.2: IC3.15 33.44,7.65 33.44,7.08 31.55,5.2 31.55,3.87 R19.2 31.45,3.78 30.51,2.83 10.96,2.83 10.77,3.02 10.77,11.52 7.37,14.92 4.34,14.92 AVRISP.4
N$1
  Top 0.2: U$2.C 45.62,83.87 47.6,83.87 49.21,85.48 49.21,89.07 S2.3
N$3
  Top 0.2: U$9.C 48.17,34.38 50.62,34.38 50.72,34.47 S9.3
N$8
  Top 0.2: U$7.C 6.52,38.06 6.52,37.31 3.78,34.57 S7.3
N$12  (via drill 5)
  other vias: 19.01,93.67
N$13  (via drill 5)
  other vias: 44.76,94.04
N$14  (via drill 5)
  other vias: 18.85,26.59
N$15  (via drill 5)
  other vias: 45.04,26.35
N$16
  Top 0.2: U$8.C 28.05,39.29 28.05,37.31 26.92,36.17 S8.3
N$17
  Top 0.2: Q1.1 44.77,88.31 43.35,88.31 43.26,88.41 R13.2 43.16,88.5 40.71,88.5 R14.2
N$18
  Top 0.2: U$6.C 46.85,52.14 49.49,52.14 49.96,52.61 S6.3
N$19  (via drill 0.35)
  Top 0.2: v47.79,86.42 46.66,87.56 Q1.3
  Bottom 0.2: v47.79,86.42 56.1,86.42 57.24,87.56 K1.12
N$20
  Top 0.2: U$4.C 45.62,62.24 45.62,62.81 48.17,65.36 48.17,69.23 49.77,70.84 S4.3
N$21
  Top 0.2: U$5.C 7.75,55.82 7.75,55.54 4.91,52.7 S5.3
N$22
  Top 0.2: U$3.C 7.75,73.58 7.56,73.58 4.91,70.93 S3.3
N$31  (via drill 0.35)
  Top 0.2: v24.56,48.45 23.9,49.11 23.9,51.95 24.75,52.8 27.48,52.8 28.43,53.74 28.43,54.12 U4.14 | v24.56,45.81 24.93,45.81 25.5,45.24 27.48,45.24 28.71,46.47 28.71,46.94 R15.2
  Bottom 0.2: v24.56,45.81 v24.56,48.45
N$32
  Top 0.2: U4.17 29.94,54.12 29.94,48.74 29.85,48.64 29.85,48.08 30.89,47.04 C8.1
N$35  (via drill 0.35)
  Top 0.2: v15.32,15.33 C25.1 19.35,11.3 19.53,11.3 19.7,11.13 19.7,10.95 20.65,10 IC3.7
  Bottom 0.2: 8MHZ.2 v15.32,15.33
N$36  (via drill 0.35)
  Top 0.2: 16.82,5.67 C26.1 | C26.1 19.79,8.64 20.32,8.64 20.88,9.2 IC3.8 | v15.24,5.08 16.23,5.08 C26.1
  Bottom 0.2: 8MHZ.1 14.65,5.67 v15.24,5.08
N$37
  Top 0.2: C9.2 44.2,6.15 44.2,9.14 41.91,11.43 35.96,11.43 IC3.20
O0  (via drill 0.35)
  Top 0.2: U4.2 26.24,58.93 25.41,58.93 v25.41,61.3 | v56.86,73.01 56.67,73.2 56.67,79.06 S2.1 | v55.73,61.2 56.67,60.26 S4.1 57.33,60.83 54.31,57.8 46.47,57.8 LED15.A 46.38,57.8 42.31,57.8 36.65,63.47 35.61,63.47 v35.23,63.85 | U2.8 34.47,69.99 26.92,69.99 U2.3 26.82,69.99 v25.69,71.12 | U1.3 16.91,69.89 15.96,69.89 12.37,66.3 12.37,60.92 S3.1 12.28,60.83 11.81,60.35 v11.81,58.84 | v11.81,55.82 10.11,54.12 10.11,52.04 12.28,49.87 12.28,42.79 S5.1 | v22.95,68.38 22.57,68.38 21.82,69.14 v20.4,69.14
  Bottom 0.2: v56.86,73.01 56.86,62.34 v55.73,61.2 | v25.41,61.3 24.75,61.96 22.86,61.96 21.44,63.38 21.44,65.17 | 21.44,65.17 21.44,66.78 23,68.33 | 23,68.33 24.56,69.89 U1.8 24.56,69.99 v25.69,71.12 | v11.81,58.84 v11.81,55.82 | v20.4,69.14 19.27,70.27 17.28,70.27 17,69.99 U1.3 | v22.95,68.38 23,68.33 | v35.23,63.85 35.23,64.23 35.32,64.32 35.32,65.08 34.66,65.74 32.02,65.74 30.13,63.85 26.26,63.85 25.5,63.09 24.46,63.09 22.39,65.17 21.44,65.17
O1  (via drill 0.35)
  Top 0.2: U4.3 22.37,58.4 22.1,58.67 22.1,58.75 22.1,59.6 26.35,63.85 27.3,63.85 v28.34,64.89 | 58.18,29.66 58.18,31.64 56.95,32.87 56.95,42.12 57.52,42.69 S6.1 57.61,42.79 57.61,45.15 60.54,48.08 60.54,88.12 v54.21,94.45 | 58.18,29.66 58.18,24.56 S9.1 | S7.1 11.33,24.56 12.09,24.56 17.76,30.22 30.22,30.22 34.28,26.16 S8.1 34.47,26.07 38.06,29.66 58.18,29.66 | 38.06,69.99 36.93,69.99 U3.3 | 38.06,69.99 44.39,69.99 U3.8 | 9.82,99.46 6.52,99.46 LED1.C | 9.82,99.46 10.77,100.4 12.09,100.4 LED2.C 12.18,100.5 16.72,100.5 17.66,101.44 LED3.C 17.76,101.53 22.95,101.53 23.05,101.63 LED4.C 23.14,101.72 23.23,101.82 28.52,101.82 LED5.C 28.62,101.91 29.66,100.87 34.76,100.87 35.51,101.63 39.48,101.63 LED7.C 39.58,101.63 43.54,101.63 | 43.54,101.63 44.96,101.63 45.05,101.53 LED8.C | v38.06,73.01 38.06,69.99 | v23.71,86.14 21.91,84.34 21.35,84.34 9.82,95.87 9.82,99.46 | 43.54,101.63 v43.54,100.12
  Bottom 0.2: v28.34,64.89 30.6,64.89 34.66,68.95 35.89,68.95 36.84,69.89 U3.3 | v38.06,73.01 37.69,73.01 36.65,74.05 36.46,74.05 35.51,74.99 35.51,75.37 31.92,78.96 30.89,78.96 v23.71,86.14 | v54.21,94.45 49.21,94.45 v43.54,100.12
O2  (via drill 0.35)
  Top 0.2: U4.4 26.25,57.91 21.84,57.91 21.82,57.99 v20.31,57.99 | 17.66,41.37 17.95,41.37 26.64,32.68 36.74,32.68 45.43,41.37 46.85,41.37 LED16.C | 17.66,41.37 15.68,41.37 LED17.C | v22.2,51.76 20.31,51.76 LED18.C | v24.56,51.66 25.6,51.66 25.69,51.76 LED19.C | v17.76,53.08 15.21,55.63 15.21,58.56 16.06,59.41 16.06,59.79 LED14.C | v32.21,50.81 31.26,51.76 LED20.C | v35.42,50.81 36.36,51.76 36.65,51.76 LED21.C 36.74,51.85 38.25,53.36 v40.61,53.36 | v40.99,51.29 41.46,51.76 42.12,51.76 LED22.C 42.22,51.85 42.88,51.85 v47.98,56.95 | 47.32,59.79 46.47,59.79 LED15.C | v48.26,58.84 47.32,59.79 | v17.66,41.46 17.66,41.37 | 24.56,76.98 22.76,78.77 22.67,78.77 21.91,79.53 LED11.C | 24.56,76.98 24.56,75.09 U1.10 | 24.56,76.98 27.11,76.98 29.66,79.53 31.17,79.53 LED12.C 31.36,79.53 40.9,79.53 LED13.C 40.99,79.53 41.75,78.77 41.84,78.77 42.74,77.87 | LED10.C 55.91,99.46 54.97,100.4 50.62,100.4 LED9.C 50.53,100.4 44.49,100.4 44.2,100.12 44.2,98.61 45.05,97.76 46.28,97.76 49.3,94.73 49.3,91.9 50.44,90.77 50.44,85.57 42.74,77.87 | 42.74,77.87 44.39,76.22 44.39,75.09 U3.10 44.49,74.99 46.09,73.39 v46.09,71.4 | 47.32,59.79 47.32,61.3 48.83,62.81 v48.83,68.67
  Bottom 0.2: v22.2,51.76 24.46,51.76 v24.56,51.66 24.65,51.66 25.5,50.81 v32.21,50.81 v35.42,50.81 | v17.76,53.08 19.08,51.76 20.31,51.76 | v22.2,51.76 20.31,51.76 | v40.99,51.29 40.99,52.99 v40.61,53.36 | v48.26,58.84 48.26,57.24 v47.98,56.95 | 20.31,51.76 v20.31,57.99 | v17.66,41.46 17.66,42.22 22.2,46.75 v22.2,51.76 | v46.09,71.4 v48.83,68.67
O4  (via drill 0.35)
  Top 0.2: U4.6 20.58,56.9 20.57,56.9 20.5,56.95 20.12,57.33 20.02,57.33 19.65,57.71 19.65,58.47 v20.31,59.13 | U3.9 44.39,72.54 43.07,73.86 43.07,74.61 40.99,76.69 40.99,77.36 LED13.A 40.9,76.98 39.1,76.98 38.54,76.41 34.38,76.41 31.45,73.48 25.6,73.48 24.65,72.54 U1.9
  Bottom 0.2: v20.31,59.13 20.31,66.21 22.29,68.19 22.29,70.18 24.56,72.44 U1.9
O5  (via drill 0.35)
  Top 0.2: U4.7 19.93,56.4 19.81,56.52 19.74,56.58 19.74,57.05 19.27,57.52 19.27,59.03 23.99,63.75 v25.22,63.75 | U3.7 44.49,67.44 45.43,68.38 45.43,72.92 44.86,73.48 44.67,73.48 43.45,74.71 43.45,76.6 41.65,78.39 38.63,78.39 37.69,77.45 LED12.A 31.17,77.36 v30.04,76.22
  Bottom 0.2: v30.04,76.22 30.04,74.24 27.3,71.5 27.11,71.5 25.88,70.27 25.88,69.89 24.65,68.67 24.65,67.44 U1.7 24.65,67.34 25.41,66.59 25.41,64.42 25.22,64.23 v25.22,63.75
O6  (via drill 0.35)
  Top 0.2: U4.8 19.66,55.9 19.18,56.39 19.17,56.48 v18.51,57.14 | v21.82,73.2 21.82,77.36 LED11.A | v35.98,68.29 35.98,69.42 35.51,69.89 35.51,70.36 34.38,71.5 26.26,71.5 25.97,71.78 25.22,71.78 24.93,71.5 21.72,71.5 v21.63,71.59
  Bottom 0.2: 21.82,71.59 21.82,70.84 21.35,70.36 21.35,69.14 17,64.79 U1.5 17,64.7 17.47,64.23 17.47,58.18 v18.51,57.14 | 21.82,71.59 v21.82,73.2 | v35.98,68.29 35.89,68.19 35.89,66.97 36.84,66.02 36.84,64.89 U3.5 | v21.63,71.59 21.82,71.59
O7
  Top 0.2: U4.9 19.28,55.4 17.78,56.9 17.78,57.8 | 17.78,57.8 17.78,62.48 22.14,62.48 U1.6 24.46,64.79 25.41,64.79 27.01,66.4 28.71,66.4 30.22,67.91 32.68,67.91 34.38,66.21 42.79,66.21 44.2,64.79 U3.6 | 17.78,57.8 16.15,57.8 LED14.A
O8  (via drill 0.35)
  Top 0.2: U4.10 19.01,54.9 18.54,55.37 18.51,55.44 18.13,55.82 v17.85,55.82 | v18.98,69.61 20.31,70.93 24.93,70.93 25.6,70.27 25.6,69.89 26.73,68.76 34.57,68.76 35.89,67.44 36.84,67.44 U3.4
  Bottom 0.2: v17.85,55.82 17.85,56.29 17.28,56.86 16.34,56.86 15.58,57.61 15.58,64.89 16.91,66.21 16.91,67.34 U1.4 17,67.44 18.98,69.42 v18.98,69.61
O9  (via drill 0.35)
  Top 0.2: v52.42,90.86 52.04,90.86 50.62,92.28 50.62,98.32 LED9.A | v46.09,86.61 43.92,84.44 42.98,84.44 v38.72,80.19 | v38.25,77.07 34.47,77.07 31.45,74.05 25.6,74.05 25.22,73.67 24.37,73.67 23.23,72.54 17,72.54 U1.2 | v51.38,57.14 50.81,57.14 46.19,52.51 46.19,52.04 45.95,52.04 45.21,51.31 45.21,49.69 43.14,47.62 41.88,47.62 41.19,48.31 37.1,48.31 36.25,47.46 33.88,47.46 33.53,47.81 33.53,53.76 33.71,53.94 33.71,54.49 33.33,54.87 32.19,54.87 U4.21 | v53.93,68.85 53.93,76.69 v54.31,77.07
  Bottom 0.2: v52.42,90.86 50.34,90.86 v46.09,86.61 46.09,85.29 v54.31,77.07 | v38.72,80.19 38.72,77.07 v38.25,77.07 38.73,76.59 38.73,76.04 39.11,75.66 39.15,75.66 41.66,73.15 41.66,72.64 41.15,72.14 38.56,72.14 38.35,72.35 37.02,72.35 36.93,72.44 U3.2 | v51.38,57.14 51.38,61.87 53.93,64.42 v53.93,68.85
O10  (via drill 0.35, 1)  (1 unrouted)
  Top 0.2: v52.33,93.6 55.91,97.19 LED10.A | v45.43,84.72 43.92,83.21 v43.92,82.93 | v38.06,81.42 37.31,80.66 30.22,80.66 28.05,78.49 25.88,78.49 22.76,81.61 20.68,81.61 17,77.92 17,75.09 U1.1 | U4.22 32.25,55.3 33.43,55.3 34.54,54.19 34.54,48.26 34.92,47.88 36.14,47.88 36.95,48.69 42.26,48.69 v42.67,48.28 | v46.74,48.77 48.26,50.29 v50.8,50.29 | v39.62,73.66 40.84,74.87 v41.85,74.87
  Bottom 0.2: v52.33,93.6 50.91,93.6 45.43,88.12 v45.43,84.72 | v43.92,82.93 39.58,82.93 v38.06,81.42 37.87,81.23 37.87,77.64 36.93,76.69 36.93,75.09 U3.1 38.21,73.67 38.34,73.67 38.34,73.66 v39.62,73.66 | v42.67,48.28 46.25,48.28 v46.74,48.77 | v41.85,74.87 44.7,77.72 45.72,77.72 v47.24,76.2 | v50.8,50.29 v55.37,50.29
O11  (via drill 0.35)
  Top 0.2: 42.77,47.24 47.79,42.22 47.79,40.71 46.94,39.86 46.94,39.39 LED16.A | v39.39,81.79 42.41,84.82 43.73,84.82 45.43,86.52 45.43,88.78 45.24,88.97 45.15,88.97 39.58,94.54 39.58,99.55 LED7.A | v39.39,76.32 39.01,76.32 38.72,76.03 35.51,76.03 34.57,75.09 U2.10 | v46.47,51.19 46.23,49.78 43.69,47.24 42.77,47.24 | v52.33,67.25 52.33,71.97 v50.44,73.86 | 32.21,55.82 U4.23 32.25,55.8 33.46,55.8 34.92,54.35 34.92,53.31 34.95,53.28 | 34.95,53.64 34.95,53.28 | 34.95,53.28 34.95,53.09 35.51,52.53 v35.51,51.85 | v37.5,47.23 38.06,47.23 38.63,46.66 41.62,46.66 42.2,47.24 42.77,47.24
  Bottom 0.2: v37.5,47.23 37.5,49.87 v35.51,51.85 | v39.39,81.79 v39.39,76.32 39.48,76.32 41.94,73.86 v50.44,73.86 | v46.47,51.19 50.72,55.44 50.72,62.15 52.33,63.75 v52.33,67.25
O12  (via drill 0.35)
  Top 0.2: U4.24 36.72,56.4 37.59,57.28 37.69,57.24 37.97,57.52 v38.06,57.52 | v22.39,86.7 22.39,95.02 22.2,95.21 22.2,100.31 22.57,100.68 29.28,100.68 30.22,99.74 34,99.74 LED6.A
  Bottom 0.2: v22.39,86.7 22.39,86.42 33.53,75.28 33.53,74.43 34.47,73.48 34.47,72.54 U2.9 34.57,72.44 35.51,71.5 37.21,71.5 40.33,68.38 40.33,57.71 40.05,57.43 38.63,57.43 38.54,57.52 v38.06,57.52
O13  (via drill 0.35)
  Top 0.2: U4.25 36.45,56.9 37.21,57.66 37.21,57.71 37.69,58.18 38.35,58.18 38.82,57.71 38.82,57.24 41.27,54.78 41.27,53.08 40.42,52.23 v40.05,52.23 | v48.55,85.76 48.55,86.61 47.79,87.37 47.79,90.67 48.08,90.95 48.08,95.39 46.09,97.38 44.86,97.38 41.75,100.5 38.82,100.5 37.12,98.8 30.6,98.8 29.75,99.64 28.62,99.64 LED5.A | v43.45,50.53 42.98,50.53 42.22,49.77 LED22.A 42.12,49.77 41.46,50.44 v40.52,50.44 | v37.12,62.05 37.5,62.05 43.92,55.63 v45.71,55.63
  Bottom 0.2: v48.55,85.76 53.46,85.76 56.2,83.02 56.2,64.42 52.04,60.26 52.04,55.82 46.75,50.53 45.71,50.53 | v43.45,50.53 45.71,50.53 | v40.05,52.23 40.05,50.91 v40.52,50.44 | v37.12,62.05 35.89,63.28 35.89,65.08 34.57,66.4 34.57,67.34 U2.7 | 45.71,50.53 v45.71,55.63
O14  (via drill 0.35)
  Top 0.2: U4.26 36.19,57.4 37.08,58.29 37.12,58.37 37.31,58.56 38.54,58.56 41.65,55.44 41.65,52.89 38.54,49.77 37.87,49.77 | 37.87,49.77 36.74,49.77 LED21.A | v21.63,85 23.05,86.42 23.05,99.55 LED4.A | v25.41,68.38 24.75,68.38 22.86,70.27 v20.68,70.27 20.59,70.27 19.27,68.95 15.58,68.95 13.03,66.4 13.03,65.45 13.7,64.79 13.7,59.31 12.56,58.18 11.24,58.18 9.35,56.29 9.35,55.44 9.63,55.16 9.63,53.08 9.26,52.7 9.26,50.81 9.45,50.62 9.45,42.69 21.25,30.89 v29.94,30.89 | v37.87,50.62 37.87,49.77
  Bottom 0.2: v21.63,85 21.63,84.72 26.82,79.53 26.82,78.2 24.65,76.03 23.71,76.03 20.68,73.01 v20.68,70.27 | v25.41,68.38 25.41,67.91 25.88,67.44 25.88,65.83 26.82,64.89 U2.5 | v37.87,50.62 37.87,47.79 38.16,47.51 38.16,39.1 v29.94,30.89
O15  (via drill 0.35)
  Top 0.2: U4.27 35.93,57.9 36.83,58.8 36.93,58.84 v38.06,59.98 | v15.02,91.62 15.02,94.36 17.66,97 17.66,99.27 LED3.A | U2.4 26.82,67.34 25.88,66.4 23.99,66.4 22.1,68.29 v21.44,68.29 21.44,68.19 19.83,68.19 19.65,68.38 15.58,68.38 13.41,66.21 13.41,65.64 14.64,64.42 14.64,51.66 22.76,43.54 v25.69,43.54 | v30.51,48.36 31.17,49.02 31.17,49.68 LED20.A
  Bottom 0.2: v15.02,91.62 15.02,91.43 20.78,85.67 21.91,85.67 27.2,80.38 27.2,76.69 25.6,75.09 25.6,74.71 24.37,73.48 24.18,73.48 22.29,71.59 22.29,70.74 21.72,70.18 21.72,68.57 v21.44,68.29 | v25.69,43.54 v30.51,48.36 | v38.06,59.98 38.06,70.08 37.21,70.93 34.1,70.93 31.36,68.19 31.36,66.59 30.32,65.55 28.71,65.55 26.92,67.34 U2.4
O16  (via drill 0.35)
  Top 0.2: U4.28 35.54,58.4 36.2,59.05 36.17,59.13 37.54,60.49 | v27.01,49.68 25.79,49.68 LED19.A | v43.16,55.44 43.16,55.82 38.35,60.64 37.69,60.64 37.54,60.49 | v14.36,94.26 12.18,96.43 12.18,98.32 LED2.A | 37.54,60.49 34.95,63.09 34.47,63.09 v30.7,66.87 | v36.46,46.38 37,45.83 v40.55,45.83
  Bottom 0.2: v27.01,49.68 33.15,49.68 v36.46,46.38 | v40.55,45.83 40.55,47.47 39.76,48.26 39.76,48.83 40.71,49.77 40.8,49.77 43.16,52.14 v43.16,55.44 | v14.36,94.26 14.36,93.22 19.83,87.74 19.83,87.18 20.97,86.04 22.1,86.04 27.86,80.28 27.86,77.83 | 27.86,77.83 27.86,73.48 26.92,72.54 U2.2 | v30.7,66.87 30.7,77.45 30.32,77.83 27.86,77.83
O17  (via drill 0.35)
  Top 0.2: U4.29 35.28,58.9 35.61,59.23 35.61,60.45 32.68,63.38 v32.11,63.38 | 26.35,44.2 29.56,44.2 31.73,46.38 31.73,48.64 33.15,50.06 33.15,54.12 v33.06,54.21 | 26.35,44.2 25.22,44.2 20.31,49.11 20.31,49.68 LED18.A | v12.47,91.24 6.52,97.19 LED1.A | v20.97,80.94 20.97,78.77 21.2,78.53 | 21.2,78.53 21.35,78.39 22.57,78.39 23.61,77.36 23.61,74.61 24.18,74.05 25.03,74.05 25.97,74.99 26.82,74.99 U2.1 | 26.35,44.2 26.35,43.26 25.97,42.88 21.35,42.88 v14.64,49.59 | v9.63,58.37 9.63,65.27 9.35,65.55 9.35,66.11 12.28,69.04 13.41,69.04 15.96,71.59 15.96,72.92 17.09,74.05 17.38,74.05 20.97,77.64 20.97,78.3 21.2,78.53
  Bottom 0.2: v33.06,54.21 33.06,56.29 31.92,57.43 31.07,57.43 30.79,57.71 30.79,62.05 v32.11,63.38 | v12.47,91.24 12.47,89.44 v20.97,80.94 | v14.64,49.59 14.64,49.96 9.63,54.97 v9.63,58.37
O18  (via drill 0.35)
  Top 0.2: v32.11,62.05 32.11,59.41 U4.30 | 60.16,63.66 60.16,82.17 49.68,92.66 49.68,94.92 45.34,99.27 45.15,99.27 LED8.A | 60.16,63.66 60.16,49.87 41.84,31.55 24.56,31.55 16.81,39.29 15.68,39.29 LED17.A | v48.17,63.09 46.66,61.58 41.94,61.58 41.37,62.15 41.37,62.53 39.95,63.94 39.39,63.94 39.29,63.85 36.46,63.85 35.61,64.7 34.38,64.7 U2.6 | 60.16,63.66 v51.29,63.66
  Bottom 0.2: v32.11,62.05 32.11,62.43 34.38,64.7 U2.6 | v48.17,63.09 49.59,63.09 50.15,63.66 v51.29,63.66
P0  (via drill 0.35)
  Top 0.2: U4.36 28.96,62.1 28.57,62.48 28.57,62.95 30.04,64.42 v30.04,66.21 | v43.26,79.34 43.26,83.78 U$2.A | v40.52,76.22 40.24,76.22 37.5,73.48 32.02,73.48 31.36,72.82 v30.04,72.82 | v49.68,57.14 44.67,52.14 U$6.A | v50.44,68.76 v50.44,63
  Bottom 0.2: v40.52,76.22 43.26,78.96 v43.26,79.34 43.35,78.96 46.28,78.96 51.1,74.14 51.1,73.58 50.44,72.92 v50.44,68.76 | v30.04,66.21 v30.04,72.82 | v49.68,57.14 49.68,62.24 v50.44,63
P1  (via drill 0.35)
  Top 0.2: U4.37 28.46,61.96 28.32,62.1 28.24,62.05 v28.05,62.05 | v8.78,54.88 8.78,38.16 U$7.A | v8.22,58.37 8.22,71.88 9.92,73.58 U$3.A | v26.82,62.72 25.88,62.72 22.86,59.69 v22.86,59.41 | v22.86,54.21 19.83,54.21 17.57,51.95 v15.3,51.95 | v12.47,54.78 11.52,54.78 10.77,54.02 v10.77,52.33
  Bottom 0.2: v8.22,58.37 8.78,57.8 v8.78,54.88 8.78,54.78 10.77,52.8 v10.77,52.33 | v28.05,62.05 27.48,62.05 v26.82,62.72 | v22.86,54.21 v22.86,59.41 | v12.47,54.78 v15.3,51.95
P2  (via drill 0.35)
  Top 0.2: U4.33 30.46,62.21 30.86,62.61 30.89,62.62 31.73,62.62 31.83,62.72 32.4,62.72 v33.25,61.87 | v57.9,46.38 45.9,34.38 U$9.A | v57.9,64.32 57.52,64.32 52.7,69.14 52.7,72.54 50.72,74.52 50.15,74.52 47.13,71.5 47.13,64.89 44.49,62.24 43.35,62.24 | 43.35,62.24 U$4.A 43.26,62.24 | v35.61,53.36 37.69,53.36 38.82,54.5 v40.61,54.5 | v43.35,62.99 43.35,62.25 43.35,62.24
  Bottom 0.2: v57.9,64.32 v57.9,46.38 | v33.25,61.87 33.25,57.71 34.1,56.86 34.97,56.86 35.2,56.63 35.2,53.77 v35.61,53.36 | v40.61,54.5 41,54.88 41,56.63 41.73,57.36 43.06,57.36 43.06,58.42 43.07,58.43 43.07,61.74 43.35,62.02 v43.35,62.99
P3  (via drill 0.35)
  Top 0.2: U4.34 29.96,62.34 30.35,62.74 30.41,62.81 31.64,64.04 32.96,64.04 v35.61,61.39 | v10.86,55.82 10.01,55.82 U$5.A | v16.62,46.66 17,46.66 23.71,39.95 29.66,39.95 30.22,39.39 U$8.A 30.41,39.39 34.2,43.17 v39.7,43.17
  Bottom 0.2: v10.86,55.82 10.86,54.88 16.62,49.11 v16.62,46.66 | v35.61,61.39 35.61,57.9 36.65,56.86 37.59,56.86 38.44,56.01 38.44,51.57 39.01,51 39.01,43.87 v39.7,43.17
P4  (via drill 0.35)
  Top 0.2: U4.35 29.46,62.23 29.13,62.56 v29.28,62.72 | v28.62,19.83 28.62,16.34 IC3.32 | v22.86,51.1 22.86,52.04 25.03,54.21 v25.41,54.21
  Bottom 0.2: v28.62,19.83 28.62,20.4 25.03,23.99 25.03,34.85 22.86,37.02 v22.86,51.1 | v25.41,54.21 25.41,56.29 26.54,57.43 29.94,57.43 30.13,57.61 30.13,61.87 v29.28,62.72
R1IN  (via drill 0.35)
  Top 0.2: v48.92,17.76 50.81,15.87 U6.13 | v39.2,32.21 24.46,32.21 16.15,40.52 14.83,40.52 13.98,41.37 v13.98,58.65 | v15.58,65.83 20.78,65.83 v22.1,64.51
  Bottom 0.2: v48.92,17.76 39.2,27.48 v39.2,32.21 | v13.98,58.65 13.98,64.23 v15.58,65.83 | v22.1,64.51 22.48,64.51 24.27,62.72 25.88,62.72 26.54,63.38 27.67,63.38 29.18,61.87 29.18,59.69 J1.16 29.09,59.69 26.73,59.69 J1.18
R1OUT  (via drill 0.35)
  Top 0.2: v35.13,15.68 47.98,15.68 48.45,15.21 51.85,15.21 52.14,15.49 52.14,16.25 51.29,17.09 U6.12 | v30.41,18.32 30.41,16.43 30.32,16.34 IC3.30
  Bottom 0.2: v35.13,15.68 34.76,15.68 32.11,18.32 31.55,18.32 31.45,18.23 30.51,18.23 v30.41,18.32
REG_FB  (via drill 0.35)
  Top 0.2: v26.16,79.15 v31.55,84.53
  Bottom 0.2: C11.1 6.33,79.53 6.33,74.9 C13.1 6.42,75.47 16.06,75.47 19.46,78.87 22.76,78.87 C14.2 22.95,78.96 23.14,79.15 v26.16,79.15 | v31.55,84.53 32.59,85.57 32.59,86.8 U7.4
REG_P_O
  Bottom 0.2: C14.1 22.95,88.69 31.55,80.09 32.3,80.09 D1.C 32.4,80 33.44,78.96 37.02,78.96 37.21,79.15 37.21,81.32 36.08,82.45 36.08,86.8 U7.2
RELAY_NC  (via drill 0.35)
  Top 0.2: v54.31,87.08 54.31,80.09 v47.41,73.2
  Bottom 0.2: v54.31,87.08 57.24,90.01 57.24,92.66 K1.10 | v47.41,73.2 46.94,73.2 45.43,71.69 45.43,66.97 44.2,65.74 43.92,65.74 42.69,64.51 42.69,60.45 41.94,59.69 J1.6
RELAY_NO
  Bottom 0.2: K1.8 57.33,97.76 57.43,97.76 59.41,95.77 59.41,73.67 57.24,71.5 57.24,59.98 57.26,56.32 55.37,56.32 55.3,56.32 46.19,47.2 43.45,47.2 43.45,46.17 42.34,45.06 40.32,45.06 39.94,45.44 39.76,46.19 39.39,46.56 39.39,54.59 J1.7
RESET  (via drill 0.35)
  Top 0.2: IC3.29 31.1,20.97 | 31.1,20.97 31.1,21.25 R16.2 | v28.34,21.63 27.58,20.87 5.57,20.87 2.27,17.57 1.79,17.57 AVRISP.5 | 31.1,20.97 v30.32,20.97
  Bottom 0.2: v28.34,21.63 29.66,21.63 v30.32,20.97 30.41,20.97 32.49,18.89 35.13,18.89 47.7,6.33 52.7,6.33 S10.2
RLY_OUT  (via drill 0.35)
  Top 0.2: v7.08,14.26 7.37,13.98 7.37,10.39 7.08,10.11 7.08,3.87 9.26,1.7 26.07,1.7 26.45,2.08 31.45,2.08 R19.1 | v7.08,31.73 7.08,37.59 7.27,37.78 7.27,54.31 8.97,56.01 8.97,70.46 25.22,86.7 40.61,86.7 R14.1
  Bottom 0.2: v7.08,31.73 v7.08,14.26
RX
  Top 0.2: R17.1 37.5,2.08 35.89,2.08 35.13,1.32 2.93,1.32 2.55,1.7 DEBUG.1
SCK
  Top 0.2: R17.2 37.5,7.49 IC3.17 35.7,9.26 35.13,9.26 34.19,10.2 32.68,10.2 28.71,14.17 28.71,14.64 22.86,20.5 5.76,20.5 3.21,17.95 3.21,17.47 1.79,16.06 1.79,15.02 AVRISP.3
SCL  (via drill 0.35)
  Top 0.2: IC3.28 31.9,17.66 | 31.9,17.66 31.9,20.04 R7.2 | v26.16,62.05 26.92,61.3 26.92,60.16 U4.40 | v22.2,63.56 16.43,63.56 v14.07,65.93 | v31.83,17.66 31.9,17.66
  Bottom 0.2: v26.16,62.05 25.22,62.05 24.93,62.34 23.42,62.34 v22.2,63.56 | v14.07,65.93 11.62,65.93 10.29,64.6 10.29,56.2 10.2,56.1 10.2,54.97 15.96,49.21 15.96,38.16 24.65,29.47 24.65,22.86 29.09,18.42 29.37,18.42 30.13,17.66 v31.83,17.66
SDA  (via drill 0.35)
  Top 0.2: IC3.27 32.7,18.83 34.56,20.69 | 34.56,20.69 R6.2 | v38.72,64.51 37.4,65.83 34.19,65.83 32.49,67.53 30.41,67.53 29.37,66.49 29.37,64.32 27.39,62.34 27.39,60.16 U4.39 | v39.67,63.28 44.3,58.65 47.51,58.65 47.98,58.18 51.66,58.18 56.2,62.72 58.47,62.72 58.65,62.53 58.65,56.76 48.17,46.28 48.17,38.91 v42.12,32.87 | v34.57,20.68 34.56,20.69
  Bottom 0.2: v38.72,64.51 38.72,64.23 v39.67,63.28 | v42.12,32.87 38.91,32.87 34.57,28.52 v34.57,20.68
SW_ON  (via drill 0.35)
  Top 0.2: 14.73,84.25 10.77,84.25 5.95,89.07 S1.3 | 14.73,84.25 17.76,84.25 R11.2 | v22.2,19.83 27.2,14.83 IC3.1 | v8.12,57.43 7.46,58.09 7.46,72.25 10.58,75.37 10.58,75.84 11.99,77.26 14.54,77.26 14.73,77.45 14.73,84.25
  Bottom 0.2: v22.2,19.83 22.2,31.36 8.6,44.96 8.6,54.02 8.12,54.5 v8.12,57.43
T1IN
  Top 0.2: U6.11 40.24,18.42 36.17,22.48 30.89,22.48 29.56,21.16 29.56,16.34 IC3.31
T1OUT  (via drill 0.35)
  Top 0.2: v52.51,29 52.51,15.3 51.85,14.64 51.29,14.64 U6.14
  Bottom 0.2: v52.51,29 52.51,31.45 38.61,43.18 38.61,45.36 38.54,45.43 38.54,50.91 36.93,52.51 33.53,52.51 31.83,54.21 31.83,54.59 J1.13 31.73,54.69 31.73,55.06 29.94,56.86 28.52,56.86 26.73,55.06 26.73,54.69 J1.17
TX  (via drill 0.35)
  Top 0.2: v32.68,2.17 34.47,2.17 R18.1
  Bottom 0.2: v32.68,2.17 4.63,2.17 2.55,4.25 DEBUG.2
V+
  Top 0.2: C3.1 56.95,9.92 56.95,10.58 55.91,11.62 55.91,12.47 56.76,13.32 U6.2
V-
  Top 0.2: C4.1 54.02,9.92 54.02,15.68 56.76,18.42 U6.6
V_BAT
  Top 0.2: IC3.19 41.52,10.8 43.5,8.82 43.5,5.59 | 43.5,5.59 R5.1 | R12.1 42.24,5.59 43.5,5.59
VCC  (via drill 0.35)
  Top 0.2: IC3.18 35.79,9.86 35.87,9.78 36.55,9.78 38.23,8.1 | R5.2 42.6,3.05 39.82,3.05 39.65,3.22 39.65,6.69 38.23,8.1 | DEBUG.3 2.55,6.89 2.55,7.08 4.44,8.97 4.44,12.28 4.34,12.37 AVRISP.2 | v19.17,9.35 18.89,9.63 18.89,10.48 C33.2 | R16.1 31.55,23.33 33.44,23.33 R7.1 33.53,23.33 35.51,23.33 R6.1 | U6.16 51.19,11.99 51,11.81 51,9.92 C5.1 50.91,9.82 46.75,9.82 v44.96,8.03 | IC3.4 27.3,12.37 27.86,12.37 28.15,12.09 28.15,11.14 27.86,10.86 27.3,10.86 IC3.6 27.2,10.77 v25.97,10.77 | v27.86,17.28 27.86,20.12 31.07,23.33 31.45,23.33 R16.1 | v38.25,8.12 38.23,8.1 | U4.18 30.51,54.21 30.89,54.21 U4.19 30.98,54.12 30.98,53.65 31.83,52.8 31.92,52.8 32.4,52.33 v32.4,52.23 | 29.47,52.23 29.47,51.48 28.81,50.81 C7.2 28.71,50.72 28.71,48.45 27.96,47.7 27.96,46.38 27.67,46.09 25.79,46.09 | 29.47,52.23 29.47,54.12 U4.16 | 29.47,52.23 v29.18,52.23 | 25.79,46.09 25.6,46.09 20.78,50.91 v18.89,50.91 | 6.38,91.47 6.89,90.95 7.75,90.95 | 6.38,91.47 5.2,92.66 5.2,92.94 C6.1 | 7.75,90.95 8.6,90.95 13.6,85.95 17.76,85.95 R11.1 | v6.23,91.24 6.33,91.33 6.33,91.43 6.38,91.47 | v2.74,72.73 2.74,92.75 4.34,94.36 6.99,94.36 7.75,93.6 7.75,90.95 | v10.11,65.83 v11.62,64.32 | v28.52,25.97 31.07,23.42 R16.1 | v25.79,46 25.79,46.09
  Bottom 0.2: 25.97,10.2 v25.97,10.77 | 25.97,10.2 22.95,7.18 C31.+ 22.76,7.08 20.5,9.35 v19.17,9.35 19.17,13.95 C20.+ 15.33,13.27 15.11,12.37 4.34,12.37 AVRISP.2 | 31.45,8.03 28.24,8.03 26.07,10.2 25.97,10.2 | 31.45,8.03 38.25,8.03 | 38.25,8.03 v44.96,8.03 | v27.86,17.28 29.09,17.28 31.45,14.92 31.45,8.03 | v38.25,8.12 38.25,8.03 | v29.18,52.23 v32.4,52.23 | v18.89,50.91 16.53,53.27 16.53,54.59 J1.25 16.43,54.69 16.43,55.16 12.94,58.65 12.94,63 v11.62,64.32 | K1.1 52.04,87.65 52.04,89.44 55.63,93.03 55.63,93.13 57.14,94.64 58.65,94.64 58.94,94.92 58.94,95.58 57.33,97.19 54.59,97.19 49.77,102.01 16.25,102.01 9.35,95.11 MT1.F1 9.82,95.68 8.03,97.47 6.8,97.47 6.23,96.91 v6.23,91.24 | v2.74,72.73 5.67,69.8 6.23,69.8 C13.2 6.33,69.8 6.33,65.27 C12.1 6.42,65.83 v10.11,65.83 | v28.52,25.97 28.52,30.7 25.5,33.72 25.5,42.69 24.93,43.26 24.93,45.15 v25.79,46
VIN_BRD
  Bottom 0.2: 52.8,76.41 42.41,86.8 37.78,86.8 U7.1 | 52.8,76.41 54.59,76.41 54.97,76.79 54.97,80.38 54.69,80.66 C10.+ | 52.8,76.41 52.8,70.18 50.72,68.1 49.96,68.1 43.45,61.58 43.45,58.28 43.43,58.26 43.43,57.02 41.94,56.76 41.94,54.69 J1.5
(copper drawn outside any net)
  shapes: Top area x156

### Text on the board
tNames: Bridge | Bridge
bNames: JOYSTICK V1.0 | 1